# EasyEDA Pro project MN42_v2.eprj, board MOAR_Board
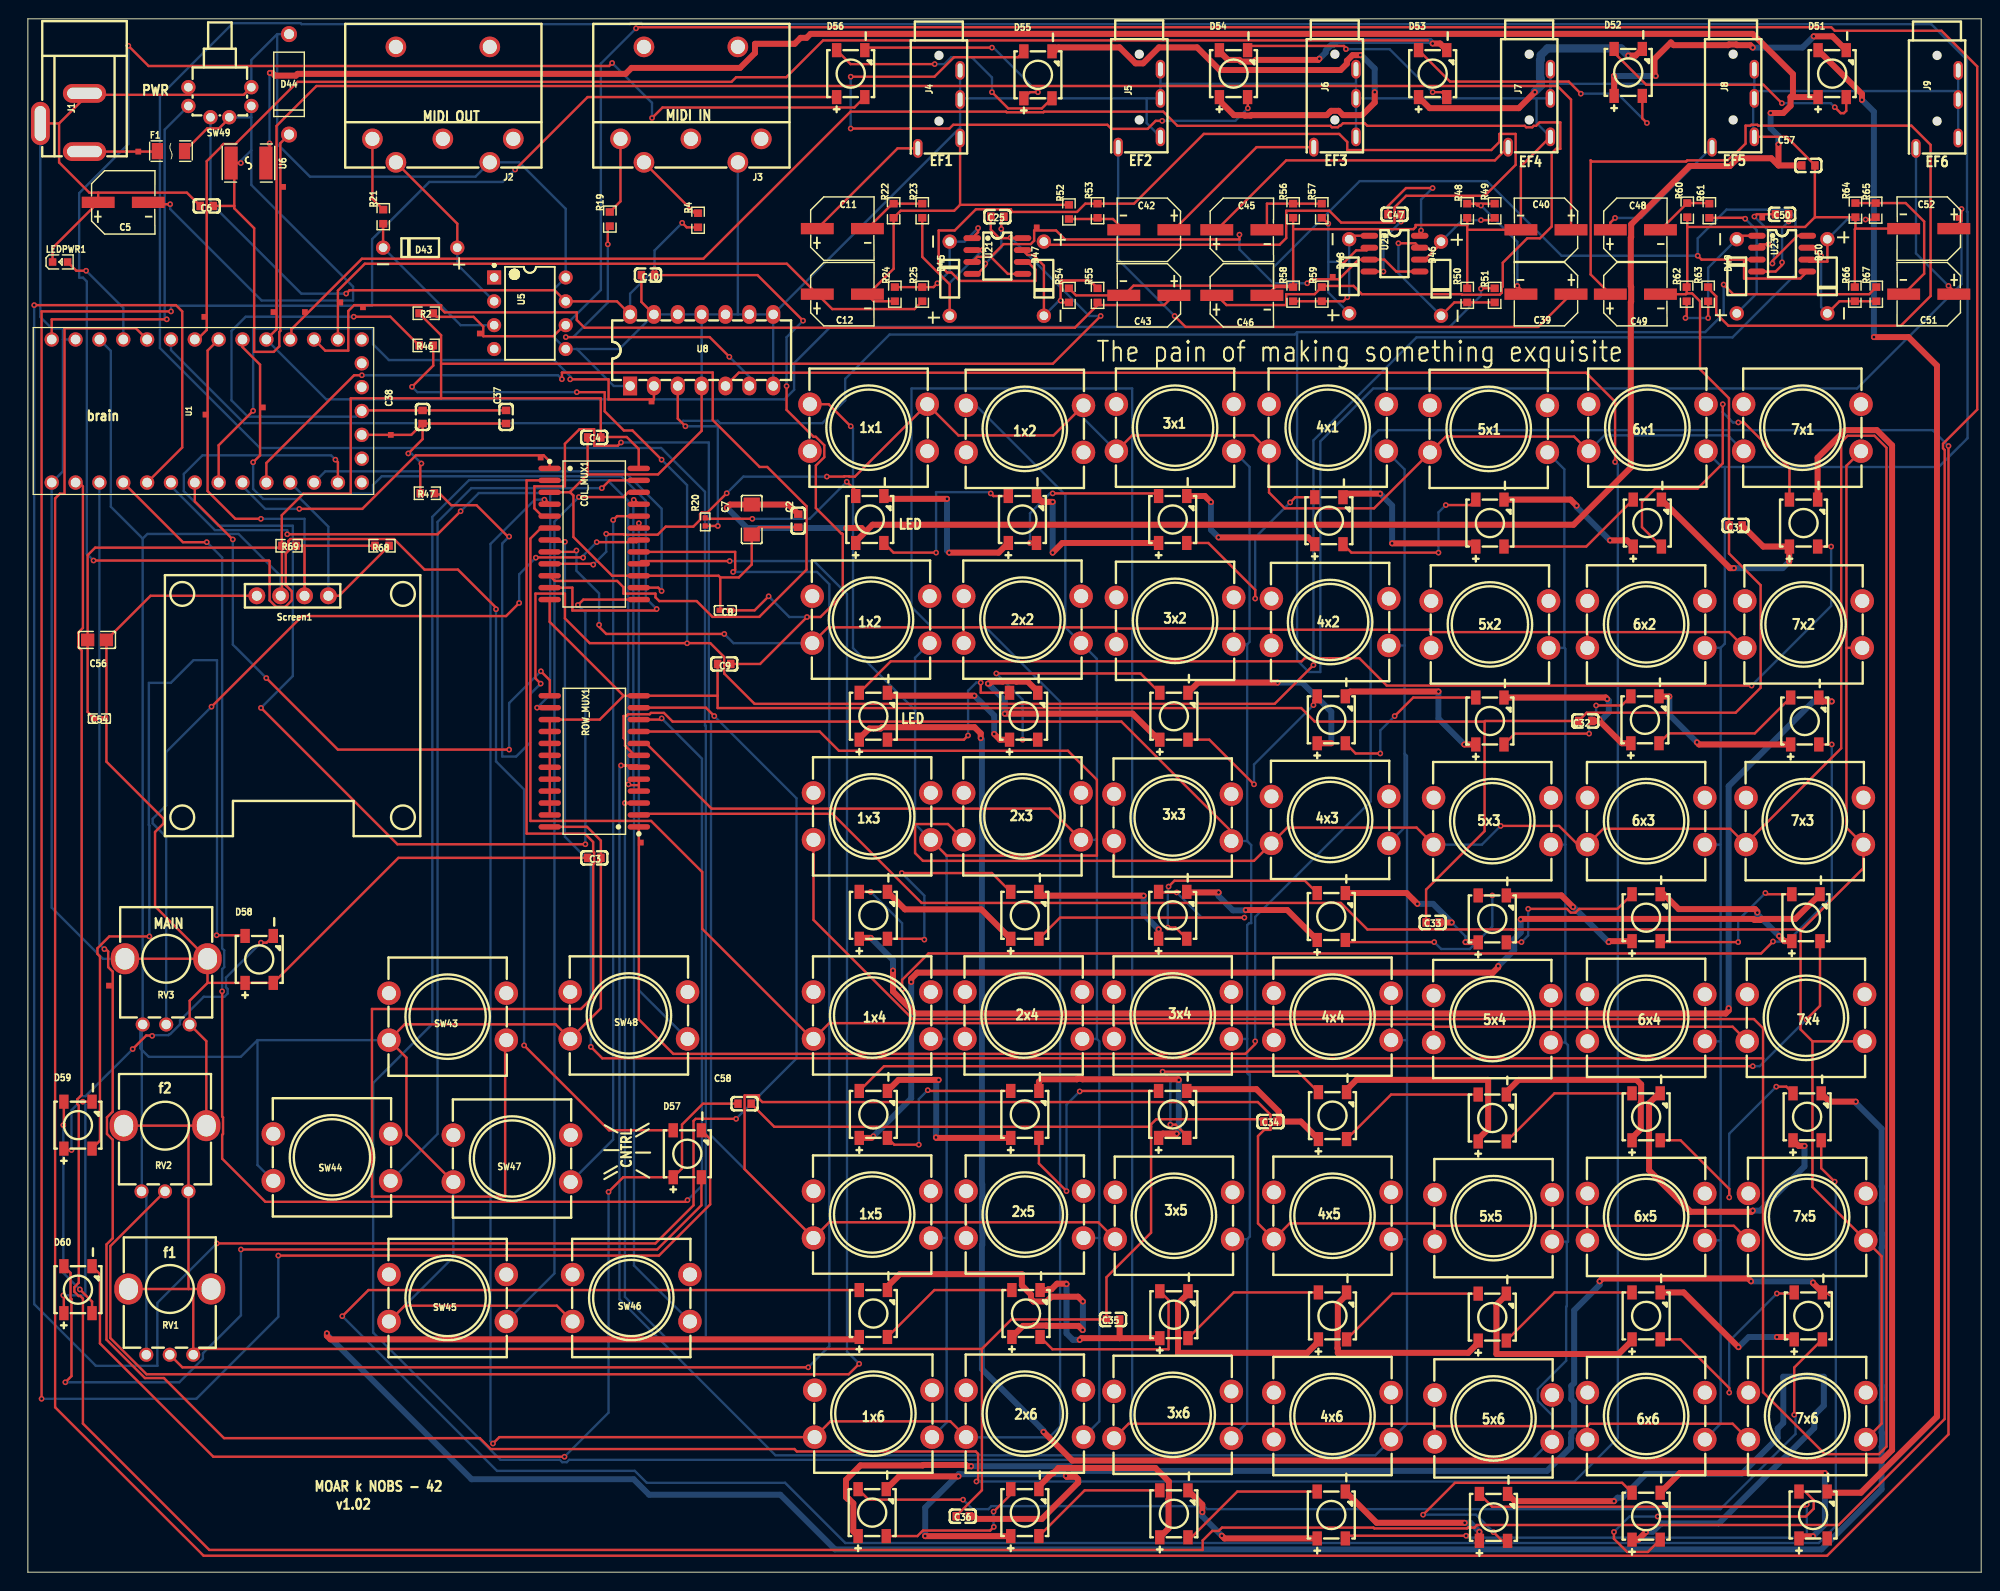
[diagram p3: board, top side]
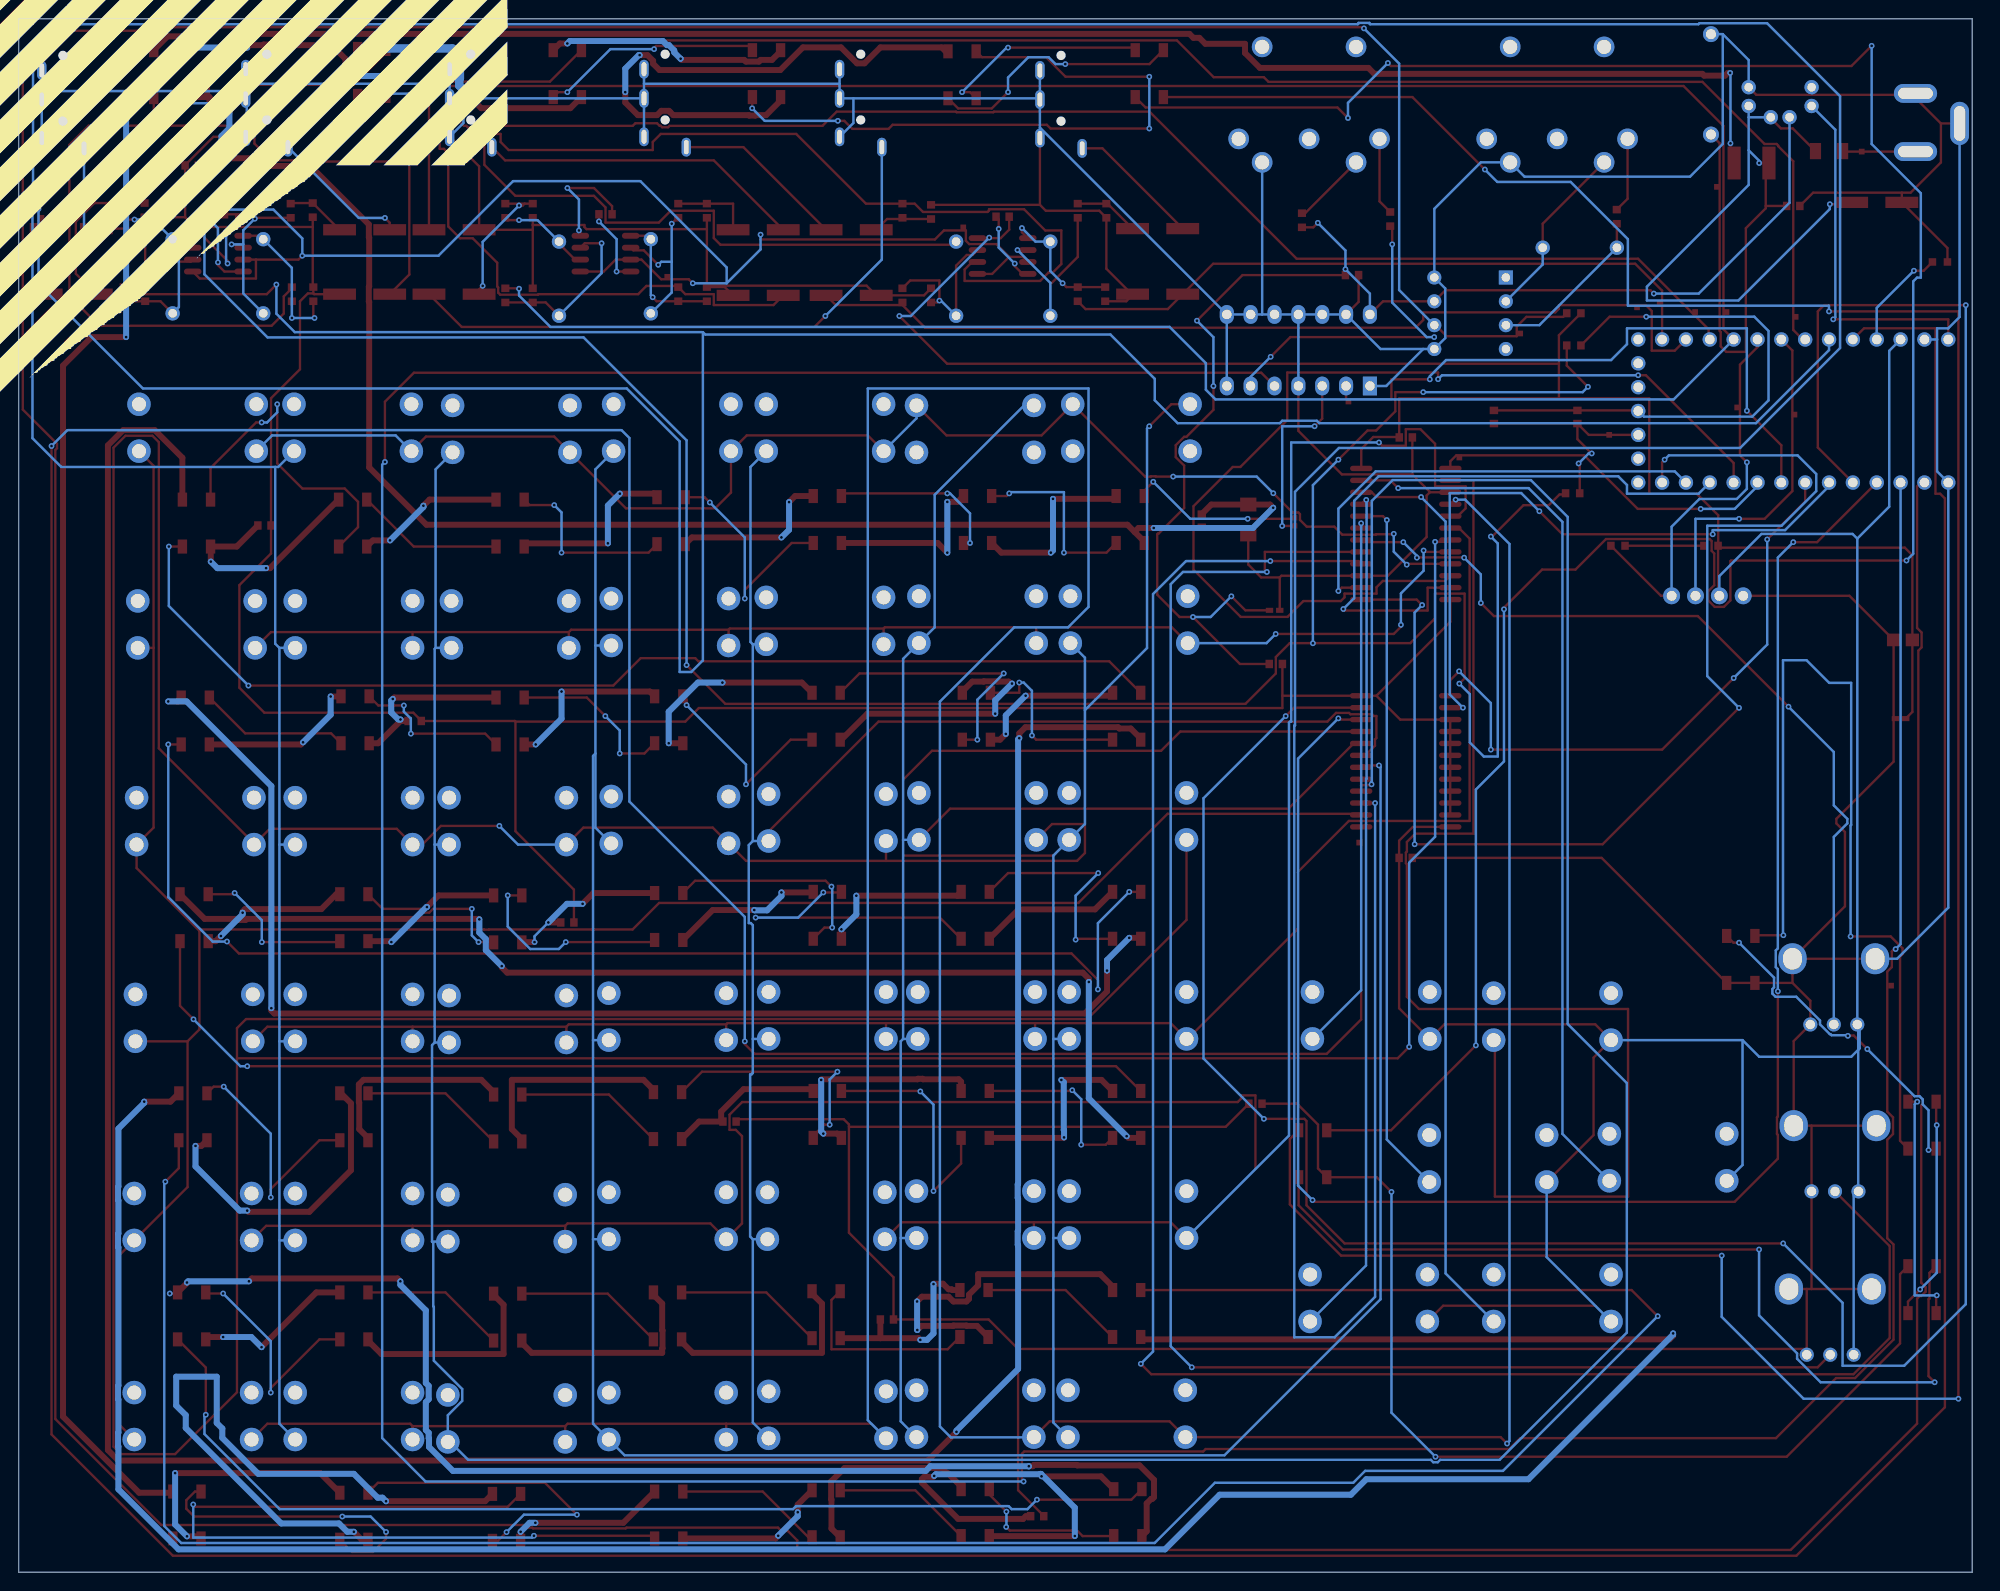
[diagram p4: board, bottom side, seen from below]

Outline 208.03 x 165.48 mm; copper layers: Top Layer, Bottom Layer. Coordinates in mm from the lower left corner of the outline.
Outline path: 0,165.48 0,0 208.03,0 208.03,165.48 0,165.48
Stack: Top Layer 0.035mm / Dielectric1 1.51mm FR4 er 4.5 / Bottom Layer 0.035mm

## Design rules (mm)
template: User Custom Config
spacing safeClearance (default): track to track 0.152, other pairs 0.152 to 0.3
track width trackWidth (default): min 0.127, default 0.254, max 2.54
differential pair differentialPair (default): width min 0.127, default 0.254, max 2.54; gap min 0.152, default 0.152
via viaSize (default): diameter min 0.5, default 0.61, max 10; hole min 0.3, default 0.305, max 5.999

## Placement (name value [footprint] x y rotation side)
C2  100nF  [C0603]  82.04 112.01 270 top
C3  100nF  [C0603]  60.33 76.09 0 top
C4  100nF  [C0603]  60.31 120.88 0 top
C5  220uF  [CAP-SMD_BD6.3-L6.6-W6.6-FD]  10.16 145.92 0 top
C6  100nF  [C0603]  19.05 145.54 0 top
C7  100uF  [C1206]  77.09 112.14 90 top
C8  1uF  [C0402]  74.28 102.47 180 top
C9  100nF  [C0603]  74.16 96.75 180 top
C10  100nF  [C0603]  66.04 138.18 0 top
C11  1uF  [CAP-SMD_BD6.3-L6.6-W6.6-FD]  86.74 143.13 0 top
C12  1uF  [CAP-SMD_BD6.3-L6.6-W6.6-FD]  86.74 136.14 0 top
C25  100nF  [C0603]  103.25 144.4 180 top
C31  100nF  [C0603]  181.86 111.51 180 top
C32  100nF  [C0603]  165.86 90.68 180 top
C33  100nF  [C0603]  149.61 69.22 180 top
C34  100nF  [C0603]  132.33 48.01 180 top
C35  100nF  [C0603]  115.57 26.92 180 top
C36  100nF  [C0603]  99.57 5.97 180 top
C37  100nF  [C0603]  50.93 123.06 270 top
C38  4.7uF  [C0603]  42.04 123.06 270 top
C39  1uF  [CAP-SMD_BD6.3-L6.6-W6.6-FD]  161.67 136.14 180 top
C40  1uF  [CAP-SMD_BD6.3-L6.6-W6.6-FD]  161.67 143 180 top
C42  1uF  [CAP-SMD_BD6.3-L6.6-W6.6-FD]  119.38 143 180 top
C43  1uF  [CAP-SMD_BD6.3-L6.6-W6.6-FD]  119.38 136.02 180 top
C45  1uF  [CAP-SMD_BD6.3-L6.6-W6.6-FD]  129.29 143 0 top
C46  1uF  [CAP-SMD_BD6.3-L6.6-W6.6-FD]  129.29 136.02 0 top
C47  100nF  [C0603]  145.54 144.65 180 top
C48  1uF  [CAP-SMD_BD6.3-L6.6-W6.6-FD]  171.2 143 0 top
C49  1uF  [CAP-SMD_BD6.3-L6.6-W6.6-FD]  171.2 136.14 0 top
C50  100nF  [C0603]  186.82 144.65 180 top
C51  1uF  [CAP-SMD_BD6.3-L6.6-W6.6-FD]  202.44 136.14 180 top
C52  1uF  [CAP-SMD_BD6.3-L6.6-W6.6-FD]  202.44 143.13 180 top
C54  1uF  [C0402]  7.62 90.93 0 top
C56  10uF  [C0805]  7.37 99.31 0 top
C57  100nF  [C0603]  189.61 149.86 0 top
C58  100nF  [C0603]  76.33 49.91 0 top
COL_MUX1  CD74HC4067M96  [SOIC-24_L15.4-W7.5-P1.27-LS10.3-BL]  60.31 110.6 270 top
D1  XL-5050RGBC-WS2812B  [LED-SMD_4P-L5.0-W5.0-BL_XL-5050RGBC]  89.66 112.14 0 top
D2  XL-5050RGBC-WS2812B  [LED-SMD_4P-L5.0-W5.0-BL_XL-5050RGBC]  105.92 112.14 0 top
D3  XL-5050RGBC-WS2812B  [LED-SMD_4P-L5.0-W5.0-BL_XL-5050RGBC]  121.92 112.14 0 top
D4  XL-5050RGBC-WS2812B  [LED-SMD_4P-L5.0-W5.0-BL_XL-5050RGBC]  138.56 112.01 0 top
D5  XL-5050RGBC-WS2812B  [LED-SMD_4P-L5.0-W5.0-BL_XL-5050RGBC]  155.7 111.76 0 top
D6  XL-5050RGBC-WS2812B  [LED-SMD_4P-L5.0-W5.0-BL_XL-5050RGBC]  172.47 111.76 0 top
D7  XL-5050RGBC-WS2812B  [LED-SMD_4P-L5.0-W5.0-BL_XL-5050RGBC]  189.1 111.76 0 top
D8  XL-5050RGBC-WS2812B  [LED-SMD_4P-L5.0-W5.0-BL_XL-5050RGBC]  90.04 91.19 0 top
D9  XL-5050RGBC-WS2812B  [LED-SMD_4P-L5.0-W5.0-BL_XL-5050RGBC]  106.05 91.19 0 top
D10  XL-5050RGBC-WS2812B  [LED-SMD_4P-L5.0-W5.0-BL_XL-5050RGBC]  122.05 91.19 0 top
D11  XL-5050RGBC-WS2812B  [LED-SMD_4P-L5.0-W5.0-BL_XL-5050RGBC]  138.81 90.8 0 top
D12  XL-5050RGBC-WS2812B  [LED-SMD_4P-L5.0-W5.0-BL_XL-5050RGBC]  155.7 90.68 0 top
D13  XL-5050RGBC-WS2812B  [LED-SMD_4P-L5.0-W5.0-BL_XL-5050RGBC]  172.21 90.8 0 top
D14  XL-5050RGBC-WS2812B  [LED-SMD_4P-L5.0-W5.0-BL_XL-5050RGBC]  189.23 90.68 0 top
D15  XL-5050RGBC-WS2812B  [LED-SMD_4P-L5.0-W5.0-BL_XL-5050RGBC]  90.04 69.98 0 top
D16  XL-5050RGBC-WS2812B  [LED-SMD_4P-L5.0-W5.0-BL_XL-5050RGBC]  106.17 69.98 0 top
D17  XL-5050RGBC-WS2812B  [LED-SMD_4P-L5.0-W5.0-BL_XL-5050RGBC]  121.92 69.98 0 top
D18  XL-5050RGBC-WS2812B  [LED-SMD_4P-L5.0-W5.0-BL_XL-5050RGBC]  138.81 69.85 0 top
D19  XL-5050RGBC-WS2812B  [LED-SMD_4P-L5.0-W5.0-BL_XL-5050RGBC]  155.96 69.6 0 top
D20  XL-5050RGBC-WS2812B  [LED-SMD_4P-L5.0-W5.0-BL_XL-5050RGBC]  172.34 69.72 0 top
D21  XL-5050RGBC-WS2812B  [LED-SMD_4P-L5.0-W5.0-BL_XL-5050RGBC]  189.36 69.72 0 top
D22  XL-5050RGBC-WS2812B  [LED-SMD_4P-L5.0-W5.0-BL_XL-5050RGBC]  90.04 48.77 0 top
D23  XL-5050RGBC-WS2812B  [LED-SMD_4P-L5.0-W5.0-BL_XL-5050RGBC]  106.17 48.77 0 top
D24  XL-5050RGBC-WS2812B  [LED-SMD_4P-L5.0-W5.0-BL_XL-5050RGBC]  121.92 48.77 0 top
D25  XL-5050RGBC-WS2812B  [LED-SMD_4P-L5.0-W5.0-BL_XL-5050RGBC]  138.94 48.64 0 top
D26  XL-5050RGBC-WS2812B  [LED-SMD_4P-L5.0-W5.0-BL_XL-5050RGBC]  155.96 48.39 0 top
D27  XL-5050RGBC-WS2812B  [LED-SMD_4P-L5.0-W5.0-BL_XL-5050RGBC]  172.34 48.51 0 top
D28  XL-5050RGBC-WS2812B  [LED-SMD_4P-L5.0-W5.0-BL_XL-5050RGBC]  189.48 48.51 0 top
D29  XL-5050RGBC-WS2812B  [LED-SMD_4P-L5.0-W5.0-BL_XL-5050RGBC]  90.04 27.56 0 top
D30  XL-5050RGBC-WS2812B  [LED-SMD_4P-L5.0-W5.0-BL_XL-5050RGBC]  106.3 27.56 0 top
D31  XL-5050RGBC-WS2812B  [LED-SMD_4P-L5.0-W5.0-BL_XL-5050RGBC]  122.05 27.43 0 top
D32  XL-5050RGBC-WS2812B  [LED-SMD_4P-L5.0-W5.0-BL_XL-5050RGBC]  138.94 27.31 0 top
D33  XL-5050RGBC-WS2812B  [LED-SMD_4P-L5.0-W5.0-BL_XL-5050RGBC]  155.96 27.18 0 top
D34  XL-5050RGBC-WS2812B  [LED-SMD_4P-L5.0-W5.0-BL_XL-5050RGBC]  172.34 27.31 0 top
D35  XL-5050RGBC-WS2812B  [LED-SMD_4P-L5.0-W5.0-BL_XL-5050RGBC]  189.61 27.31 0 top
D36  XL-5050RGBC-WS2812B  [LED-SMD_4P-L5.0-W5.0-BL_XL-5050RGBC]  89.92 6.35 0 top
D37  XL-5050RGBC-WS2812B  [LED-SMD_4P-L5.0-W5.0-BL_XL-5050RGBC]  106.17 6.35 0 top
D38  XL-5050RGBC-WS2812B  [LED-SMD_4P-L5.0-W5.0-BL_XL-5050RGBC]  122.05 6.22 0 top
D39  XL-5050RGBC-WS2812B  [LED-SMD_4P-L5.0-W5.0-BL_XL-5050RGBC]  138.81 6.1 0 top
D40  XL-5050RGBC-WS2812B  [LED-SMD_4P-L5.0-W5.0-BL_XL-5050RGBC]  156.08 5.84 0 top
D41  XL-5050RGBC-WS2812B  [LED-SMD_4P-L5.0-W5.0-BL_XL-5050RGBC]  172.34 5.97 0 top
D42  XL-5050RGBC-WS2812B  [LED-SMD_4P-L5.0-W5.0-BL_XL-5050RGBC]  190.12 6.1 0 top
D43  1N4148PF  [DO-35_BD1.9-L3.9-P7.90-D0.5-FD]  41.78 141.1 180 top
D44  SA6.0A  [DO-15_BD3.1-L6.7-P10.70-D0.8-RD]  27.81 158.5 90 top
D45  1N4148PF  [DO-35_BD1.9-L3.9-P7.90-D0.5-FD]  98.17 137.79 90 top
D46  1N4148PF  [DO-35_BD1.9-L3.9-P7.90-D0.5-FD]  150.5 137.79 270 top
D47  1N4148PF  [DO-35_BD1.9-L3.9-P7.90-D0.5-FD]  108.2 137.79 270 top
D48  1N4148PF  [DO-35_BD1.9-L3.9-P7.90-D0.5-FD]  140.72 138.05 90 top
D49  1N4148PF  [DO-35_BD1.9-L3.9-P7.90-D0.5-FD]  181.99 138.05 90 top
D50  1N4148PF  [DO-35_BD1.9-L3.9-P7.90-D0.5-FD]  191.64 138.05 270 top
D51  XL-5050RGBC-WS2812B  [LED-SMD_4P-L5.0-W5.0-BL_XL-5050RGBC]  192.15 159.64 0 top
D52  XL-5050RGBC-WS2812B  [LED-SMD_4P-L5.0-W5.0-BL_XL-5050RGBC]  170.43 159.77 0 top
D53  XL-5050RGBC-WS2812B  [LED-SMD_4P-L5.0-W5.0-BL_XL-5050RGBC]  149.61 159.64 0 top
D54  XL-5050RGBC-WS2812B  [LED-SMD_4P-L5.0-W5.0-BL_XL-5050RGBC]  128.4 159.64 0 top
D55  XL-5050RGBC-WS2812B  [LED-SMD_4P-L5.0-W5.0-BL_XL-5050RGBC]  107.57 159.51 0 top
D56  XL-5050RGBC-WS2812B  [LED-SMD_4P-L5.0-W5.0-BL_XL-5050RGBC]  87.63 159.64 0 top
D57  XL-5050RGBC-WS2812B  [LED-SMD_4P-L5.0-W5.0-BL_XL-5050RGBC]  70.23 44.58 0 top
D58  XL-5050RGBC-WS2812B  [LED-SMD_4P-L5.0-W5.0-BL_XL-5050RGBC]  24.64 65.28 0 top
D59  XL-5050RGBC-WS2812B  [LED-SMD_4P-L5.0-W5.0-BL_XL-5050RGBC]  5.33 47.62 0 top
D60  XL-5050RGBC-WS2812B  [LED-SMD_4P-L5.0-W5.0-BL_XL-5050RGBC]  5.33 30.1 0 top
F1  nSMD050-33V  [F1206]  15.24 151.38 0 top
J1  DC005  [DC-IN-TH_DC005]  3.68 154.43 270 top
J2  DIN-504B-M10  [CONN-TH_DIN-504B-M10]  44.2 156.34 180 top
J3  DIN-504B-M10  [CONN-TH_DIN-504B-M10]  70.61 156.34 180 top
J4  HC-PJ-320A  [AUDIO-SMD_HC-PJ-320A]  97.03 155.83 270 top
J5  HC-PJ-320A  [AUDIO-SMD_HC-PJ-320A]  118.36 155.96 270 top
J6  HC-PJ-320A  [AUDIO-SMD_HC-PJ-320A]  139.19 155.96 270 top
J7  HC-PJ-320A  [AUDIO-SMD_HC-PJ-320A]  159.89 155.96 270 top
J8  HC-PJ-320A  [AUDIO-SMD_HC-PJ-320A]  181.61 155.96 270 top
J9  HC-PJ-320A  [AUDIO-SMD_HC-PJ-320A]  203.33 155.83 270 top
LEDPWR1  NCD0603W1  [LED0603-RD]  3.43 139.57 0 top
NOREF  -  [Pad_e222]  107.44 143.26 0 top
NOREF#2  -  [Pad_e6017]  66.42 124.71 0 top
NOREF#3  -  [Pad_e229]  184.7 144.3 0 top
NOREF#4  -  [Pad_e215]  38.65 121.16 0 top
NOREF#5  -  [Pad_e6029]  205.61 144.27 0 top
NOREF#6  -  [Pad_e6019]  18.8 133.73 0 top
NOREF#7  -  [Pad_e6022]  35.69 134.75 0 top
NOREF#8  -  [Pad_e6021]  29.5 134.24 0 top
NOREF#9  -  [Pad_e223]  138.96 137.99 0 top
NOREF#10  -  [Pad_e6036]  25.02 124.08 0 top
NOREF#11  -  [Pad_e213]  27.18 147.57 0 top
NOREF#12  -  [Pad_e6015]  8.64 62.48 0 top
NOREF#13  -  [Pad_e6023]  33.27 135.25 0 top
NOREF#14  -  [Pad_e146]  11.76 151.33 0 top
NOREF#15  -  [Pad_e6020]  26.16 134.24 0 top
NOREF#16  -  [Pad_e6013]  48.13 131.95 0 top
NOREF#17  -  [Pad_e6035]  18.92 123.32 0 top
NOREF#18  -  [Pad_e234]  54.61 118.74 0 top
NOREF#19  -  [Pad_e236]  65.28 77.72 0 top
R2  4.7kΩ  [R0603]  42.42 134.11 0 top
R4  220Ω  [R0603]  71.37 144.02 270 top
R19  220Ω  [R0603]  61.98 144.14 270 top
R20  33Ω  [R0402]  72.14 111.89 90 top
R21  220Ω  [R0603]  37.85 144.4 90 top
R22  100kΩ  [R0603]  92.2 145.03 90 top
R23  10kΩ  [R0603]  95.25 145.03 90 top
R24  20kΩ  [R0603]  92.33 136.14 270 top
R25  4.7kΩ  [R0603]  95.25 136.14 270 top
R46  100kΩ  [R0603]  42.42 130.68 0 top
R47  100kΩ  [R0603]  42.55 114.94 0 top
R48  100kΩ  [R0603]  153.29 145.03 90 top
R49  10kΩ  [R0603]  156.21 145.03 90 top
R50  20kΩ  [R0603]  153.29 136.02 90 top
R51  4.7kΩ  [R0603]  156.21 136.02 90 top
R52  100kΩ  [R0603]  110.87 144.91 270 top
R53  10kΩ  [R0603]  113.92 145.03 270 top
R54  20kΩ  [R0603]  110.87 136.02 90 top
R55  4.7kΩ  [R0603]  113.92 136.02 270 top
R56  100kΩ  [R0603]  134.75 145.03 90 top
R57  10kΩ  [R0603]  137.8 145.03 90 top
R58  20kΩ  [R0603]  134.75 136.14 90 top
R59  4.7kΩ  [R0603]  137.8 136.14 90 top
R60  100kΩ  [R0603]  176.72 145.1 90 top
R61  10kΩ  [R0603]  179.07 145.03 90 top
R62  20kΩ  [R0603]  176.66 136.14 90 top
R63  4.7kΩ  [R0603]  178.94 136.14 90 top
R64  100kΩ  [R0603]  194.63 145.1 90 top
R65  10kΩ  [R0603]  196.79 145.1 90 top
R66  20kΩ  [R0603]  194.56 136.14 90 top
R67  4.7kΩ  [R0603]  196.85 136.14 90 top
R68  4.7kΩ  [R0603]  37.72 109.35 0 top
R69  4.7kΩ  [R0603]  27.81 109.35 0 top
ROW_MUX1  CD74HC4067M96  [SOIC-24_L15.4-W7.5-P1.27-LS10.3-BL]  60.33 86.38 90 top
RV1  10kΩ  [RES-ADJ-TH_RK09K1130A5R]  15.11 26.67 0 top
RV2  10kΩ  [RES-ADJ-TH_RK09K1130A5R]  14.61 44.07 0 top
RV3  10kΩ  [RES-ADJ-TH_RK09K1130A5R]  14.73 61.85 0 top
Screen1  HS96L03W2C03  [OLED-TH_L27.8-W27.2-P2.54_C9900033791]  28.19 104.01 0 top
SW1  HX B3F-4055-Y  [SW-TH_4P-L12.0-W12.0-P5.00-LS12.5]  89.54 121.92 0 top
SW2  HX B3F-4055-Y  [SW-TH_4P-L12.0-W12.0-P5.00-LS12.5]  106.17 121.79 0 top
SW3  HX B3F-4055-Y  [SW-TH_4P-L12.0-W12.0-P5.00-LS12.5]  122.17 121.92 180 top
SW4  HX B3F-4055-Y  [SW-TH_4P-L12.0-W12.0-P5.00-LS12.5]  138.43 121.92 180 top
SW5  HX B3F-4055-Y  [SW-TH_4P-L12.0-W12.0-P5.00-LS12.5]  155.57 121.79 180 top
SW6  HX B3F-4055-Y  [SW-TH_4P-L12.0-W12.0-P5.00-LS12.5]  172.47 121.92 180 top
SW7  HX B3F-4055-Y  [SW-TH_4P-L12.0-W12.0-P5.00-LS12.5]  188.98 121.92 180 top
SW8  HX B3F-4055-Y  [SW-TH_4P-L12.0-W12.0-P5.00-LS12.5]  89.79 101.47 180 top
SW9  HX B3F-4055-Y  [SW-TH_4P-L12.0-W12.0-P5.00-LS12.5]  105.92 101.47 180 top
SW10  HX B3F-4055-Y  [SW-TH_4P-L12.0-W12.0-P5.00-LS12.5]  122.17 101.35 180 top
SW11  HX B3F-4055-Y  [SW-TH_4P-L12.0-W12.0-P5.00-LS12.5]  138.68 101.22 180 top
SW12  HX B3F-4055-Y  [SW-TH_4P-L12.0-W12.0-P5.00-LS12.5]  155.7 100.97 180 top
SW13  HX B3F-4055-Y  [SW-TH_4P-L12.0-W12.0-P5.00-LS12.5]  172.34 100.97 180 top
SW14  HX B3F-4055-Y  [SW-TH_4P-L12.0-W12.0-P5.00-LS12.5]  189.1 100.97 180 top
SW15  HX B3F-4055-Y  [SW-TH_4P-L12.0-W12.0-P5.00-LS12.5]  89.92 80.52 180 top
SW16  HX B3F-4055-Y  [SW-TH_4P-L12.0-W12.0-P5.00-LS12.5]  105.92 80.52 180 top
SW17  HX B3F-4055-Y  [SW-TH_4P-L12.0-W12.0-P5.00-LS12.5]  121.92 80.39 180 top
SW18  HX B3F-4055-Y  [SW-TH_4P-L12.0-W12.0-P5.00-LS12.5]  138.68 80.14 180 top
SW19  HX B3F-4055-Y  [SW-TH_4P-L12.0-W12.0-P5.00-LS12.5]  155.96 80.01 180 top
SW20  HX B3F-4055-Y  [SW-TH_4P-L12.0-W12.0-P5.00-LS12.5]  172.34 80.01 180 top
SW21  HX B3F-4055-Y  [SW-TH_4P-L12.0-W12.0-P5.00-LS12.5]  189.23 80.01 180 top
SW22  HX B3F-4055-Y  [SW-TH_4P-L12.0-W12.0-P5.00-LS12.5]  89.92 59.31 180 top
SW23  HX B3F-4055-Y  [SW-TH_4P-L12.0-W12.0-P5.00-LS12.5]  106.05 59.31 180 top
SW24  HX B3F-4055-Y  [SW-TH_4P-L12.0-W12.0-P5.00-LS12.5]  121.92 59.31 180 top
SW25  HX B3F-4055-Y  [SW-TH_4P-L12.0-W12.0-P5.00-LS12.5]  138.94 59.18 180 top
SW26  HX B3F-4055-Y  [SW-TH_4P-L12.0-W12.0-P5.00-LS12.5]  155.96 58.93 180 top
SW27  HX B3F-4055-Y  [SW-TH_4P-L12.0-W12.0-P5.00-LS12.5]  172.34 59.06 180 top
SW28  HX B3F-4055-Y  [SW-TH_4P-L12.0-W12.0-P5.00-LS12.5]  189.36 59.06 180 top
SW29  HX B3F-4055-Y  [SW-TH_4P-L12.0-W12.0-P5.00-LS12.5]  89.92 38.1 180 top
SW30  HX B3F-4055-Y  [SW-TH_4P-L12.0-W12.0-P5.00-LS12.5]  106.17 38.1 180 top
SW31  HX B3F-4055-Y  [SW-TH_4P-L12.0-W12.0-P5.00-LS12.5]  122.05 37.97 180 top
SW32  HX B3F-4055-Y  [SW-TH_4P-L12.0-W12.0-P5.00-LS12.5]  138.94 37.97 180 top
SW33  HX B3F-4055-Y  [SW-TH_4P-L12.0-W12.0-P5.00-LS12.5]  156.08 37.72 180 top
SW34  HX B3F-4055-Y  [SW-TH_4P-L12.0-W12.0-P5.00-LS12.5]  172.34 37.85 180 top
SW35  HX B3F-4055-Y  [SW-TH_4P-L12.0-W12.0-P5.00-LS12.5]  189.48 37.85 180 top
SW36  HX B3F-4055-Y  [SW-TH_4P-L12.0-W12.0-P5.00-LS12.5]  90.04 16.89 180 top
SW37  HX B3F-4055-Y  [SW-TH_4P-L12.0-W12.0-P5.00-LS12.5]  106.17 16.89 180 top
SW38  HX B3F-4055-Y  [SW-TH_4P-L12.0-W12.0-P5.00-LS12.5]  121.92 16.76 180 top
SW39  HX B3F-4055-Y  [SW-TH_4P-L12.0-W12.0-P5.00-LS12.5]  138.94 16.64 180 top
SW40  HX B3F-4055-Y  [SW-TH_4P-L12.0-W12.0-P5.00-LS12.5]  156.08 16.38 180 top
SW41  HX B3F-4055-Y  [SW-TH_4P-L12.0-W12.0-P5.00-LS12.5]  172.34 16.64 180 top
SW42  HX B3F-4055-Y  [SW-TH_4P-L12.0-W12.0-P5.00-LS12.5]  189.48 16.64 180 top
SW43  HX B3F-4055-Y  [SW-TH_4P-L12.0-W12.0-P5.00-LS12.5]  44.7 59.18 180 top
SW44  HX B3F-4055-Y  [SW-TH_4P-L12.0-W12.0-P5.00-LS12.5]  32.39 44.2 180 top
SW45  HX B3F-4055-Y  [SW-TH_4P-L12.0-W12.0-P5.00-LS12.5]  44.7 29.21 180 top
SW46  HX B3F-4055-Y  [SW-TH_4P-L12.0-W12.0-P5.00-LS12.5]  64.26 29.21 180 top
SW47  HX B3F-4055-Y  [SW-TH_4P-L12.0-W12.0-P5.00-LS12.5]  51.56 44.07 180 top
SW48  HX B3F-4055-Y  [SW-TH_4P-L12.0-W12.0-P5.00-LS12.5]  64.01 59.31 180 top
SW49  TK-6580A-1  [SW-TH_TK-6580A-1]  20.45 156.59 180 top
U1  Teensy  [teensy 4.0:MODULE_DEV-15583]  19.05 123.7 90 top
U5  6N138  [DIP-8_L9.8-W6.6-P2.54-LS7.6-BL]  53.47 134.11 270 top
U6  1812L200/33GR  [F1812]  23.5 150.11 0 top
U8  SN74AHCT125N  [PDIP-14_L19.3-W6.4-P2.54-LS7.6-BL]  71.75 130.18 0 top
U21  MCP6002DRG  [SOP-8_L4.9-W3.9-P1.27-LS6.0-BL]  103.25 140.21 270 top
U22  MCP6002DRG  [SOP-8_L4.9-W3.9-P1.27-LS6.0-BL]  145.54 140.46 270 top
U23  MCP6002DRG  [SOP-8_L4.9-W3.9-P1.27-LS6.0-BL]  186.82 140.46 270 top

## Footprints (pads in the part's own frame, mm; a bottom-side part is the same pattern mirrored in y, then rotated)
AUDIO-SMD_HC-PJ-320A
  oval 2x1 hole 1.5x0.5: 1(4.15,-2.25) 2(-4.15,2.25) 3(-1.05,2.25) 4(3.05,2.25)
C0402
  rect 0.79x0.54 smd: 1(-0.545,0) 2(0.545,0)
C0603
  rect 0.8x0.9 smd: 1(-0.7,0) 2(0.7,0)
C0805
  rect 1.41x1.35 smd: 1(-1,0) 2(1,0)
C1206
  rect 1.485x1.728 smd: 1(-1.593,0) 2(1.593,0)
CAP-SMD_BD6.3-L6.6-W6.6-FD
  rect 3.5x1.2 smd: 1(-2.67,0) 2(2.67,0)
CONN-TH_DIN-504B-M10
  round 2.2 hole 1.5: 1(-7.5,3.65) 2(-5,6.15) 3(0,3.65) 4(5,6.15) 5(7.5,3.65) 6(-5,-6.15) 7(5,-6.15)
DC-IN-TH_DC005
  oval 2x4.6 hole 1.2x3.7: 1(3.1,2.35) 2(-3.1,2.35)
  oval 4.6x2 hole 3.7x1.2: 3(0.1,-2.35)
DIP-8_L9.8-W6.6-P2.54-LS7.6-BL
  rect 1.5x1.5 hole 0.9: 1(-3.81,-3.81)
  round 1.5 hole 0.9: 2(-1.27,-3.81) 3(1.27,-3.81) 4(3.81,-3.81) 5(3.81,3.81) 6(1.27,3.81) 7(-1.27,3.81) 8(-3.81,3.81)
DO-15_BD3.1-L6.7-P10.70-D0.8-RD
  round 1.7 hole 1.06: 1(-5.35,0) 2(5.35,0)
DO-35_BD1.9-L3.9-P7.90-D0.5-FD
  round 1.524 hole 0.914: 1(-3.95,0) 2(3.95,0)
F1206
  rect 1.19x1.728 smd: 1(-1.445,0) 2(1.445,0)
F1812
  rect 1.407x3.499 smd: 1(-1.853,0) 2(1.853,0)
LED0603-RD
  rect 0.8x0.8 smd: 1(-0.799,0) 2(0.799,0)
LED-SMD_4P-L5.0-W5.0-BL_XL-5050RGBC
  rect 1x1.5 smd: 1(-1.5,-2.5) 2(1.5,-2.5) 3(1.5,2.5) 4(-1.5,2.5)
OLED-TH_L27.8-W27.2-P2.54_C9900033791
  round 1.8 hole 1.05: 1(-3.81,0) 2(-1.27,0) 3(1.27,0) 4(3.81,0)
Pad_e146
  rect 0.61x0.61 smd: TP2(0,0)
Pad_e213
  rect 0.61x0.61 smd: TP3(0,0)
Pad_e215
  rect 0.61x0.61 smd: TP4(0,0)
Pad_e222
  rect 0.61x0.61 smd: TP5(0,0)
Pad_e223
  rect 0.61x0.61 smd: TP6(0,0)
Pad_e229
  rect 0.61x0.61 smd: TP7(0,0)
Pad_e234
  rect 0.61x0.61 smd: TP8(0,0)
Pad_e236
  rect 0.61x0.61 smd: TP9(0,0)
Pad_e6013
  rect 0.61x0.61 smd: TP10(0,0)
Pad_e6015
  rect 0.61x0.61 smd: TP11(0,0)
Pad_e6017
  rect 0.61x0.61 smd: TP12(0,0)
Pad_e6019
  rect 0.61x0.61 smd: TP13(0,0)
Pad_e6020
  rect 0.61x0.61 smd: TP14(0,0)
Pad_e6021
  rect 0.61x0.61 smd: TP15(0,0)
Pad_e6022
  rect 0.61x0.61 smd: TP16(0,0)
Pad_e6023
  rect 0.61x0.61 smd: TP17(0,0)
Pad_e6029
  rect 0.61x0.61 smd: TP18(0,0)
Pad_e6035
  rect 0.61x0.61 smd: TP19(0,0)
Pad_e6036
  rect 0.61x0.61 smd: TP20(0,0)
PDIP-14_L19.3-W6.4-P2.54-LS7.6-BL
  rect 1.5x2 hole 1: 1(-7.62,-3.81)
  oval 1.5x2 hole 1: 2(-5.08,-3.81) 3(-2.54,-3.81) 4(0,-3.81) 5(2.54,-3.81) 6(5.08,-3.81) 7(7.62,-3.81) 8(7.62,3.81) 9(5.08,3.81) 10(2.54,3.81) 11(0,3.81) 12(-2.54,3.81) 13(-5.08,3.81) 14(-7.62,3.81)
R0402
  rect 0.566x0.54 smd: 1(-0.433,0) 2(0.433,0)
R0603
  rect 0.806x0.864 smd: 1(-0.753,0) 2(0.753,0)
RES-ADJ-TH_RK09K1130A5R
  round 1.5 hole 1: 1(-2.5,-3.5) 2(0,-3.5) 3(2.5,-3.5)
  oval 3x3.3 hole 2x2.3: 4(4.4,3.5) 5(-4.4,3.5)
SOIC-24_L15.4-W7.5-P1.27-LS10.3-BL
  oval 0.574x2.388 smd: 1(-6.985,-4.744) 2(-5.715,-4.744) 3(-4.445,-4.744) 4(-3.175,-4.744) 5(-1.905,-4.744) 6(-0.635,-4.744) 7(0.635,-4.744) 8(1.905,-4.744) 9(3.175,-4.744) 10(4.445,-4.744) 11(5.715,-4.744) 12(6.985,-4.744) 13(6.985,4.744) 14(5.715,4.744) 15(4.445,4.744) 16(3.175,4.744) 17(1.905,4.744) 18(0.635,4.744) 19(-0.635,4.744) 20(-1.905,4.744) 21(-3.175,4.744) 22(-4.445,4.744) 23(-5.715,4.744) 24(-6.985,4.744)
SOP-8_L4.9-W3.9-P1.27-LS6.0-BL
  oval 0.63x1.865 smd: 1(-1.905,-2.683) 2(-0.635,-2.683) 3(0.635,-2.683) 4(1.905,-2.683) 5(1.905,2.683) 6(0.635,2.683) 7(-0.635,2.683) 8(-1.905,2.683)
SW-TH_4P-L12.0-W12.0-P5.00-LS12.5
  round 2.5 hole 1.5: 1(-6.25,2.5) 2(6.25,2.5) 3(-6.25,-2.5) 4(6.25,-2.5)
SW-TH_TK-6580A-1
  round 1.524 hole 0.914: 1(3.35,-1.6) 2(3.35,0.4) 3(-3.35,-1.6) 4(-3.35,0.4) 5(1,1.6) 6(-1,1.6)
teensy 4.0:MODULE_DEV-15583
  round 1.53 hole 1.02: 0(-7.62,13.97) 1(-7.62,11.43) 2(-7.62,8.89) 3(-7.62,6.35) 3.3V_1(-2.54,-16.51) 3.3V_2(7.62,11.43) 4(-7.62,3.81) 5(-7.62,1.27) 6(-7.62,-1.27) 7(-7.62,-3.81) 8(-7.62,-6.35) 9(-7.62,-8.89) 10(-7.62,-11.43) 11(-7.62,-13.97) 12(-7.62,-16.51) 13(7.62,-16.51) 14(7.62,-13.97) 15(7.62,-11.43) 16(7.62,-8.89) 17(7.62,-6.35) 18(7.62,-3.81) 19(7.62,-1.27) 20(7.62,1.27) 21(7.62,3.81) 22(7.62,6.35) 23(7.62,8.89) G1(-7.62,16.51) G2(0,-16.51) G3(7.62,13.97) ON-OFF(5.08,-16.51) PGM(2.54,-16.51) VBAT(-5.08,-16.51) VIN(7.62,16.51)

## Nets
As in the schematic, except:
GND: C2.2 C3.1 C4.1 C5.1 C6.1 C7.1 C8.2 C9.2 C10.1 C12.2 C31.2 C32.2 C33.2 C34.2 C35.2 C36.2 C40.2 C43.2 C46.2 C49.2 C52.2 C54.2 C56.2 C57.2 C58.2 COL_MUX1.3 COL_MUX1.12 COL_MUX1.15 D44.2 D58.1 D58.2 J1.2 J1.3 J2.2 J3.2 J4.2 J4.3 J4.4 J5.2 J5.3 J5.4 J6.2 J6.3 J6.4 J7.2 J7.3 J7.4 J8.2 J8.3 J8.4 J9.2 J9.3 J9.4 LEDPWR1.1 R22.1 R24.2 R48.1 R50.2 R52.1 R54.2 R56.1 R58.2 R60.1 R62.2 R64.1 R66.2 ROW_MUX1.12 ROW_MUX1.15 ROW_MUX1.16 ROW_MUX1.17 ROW_MUX1.18 ROW_MUX1.19 ROW_MUX1.20 ROW_MUX1.21 ROW_MUX1.22 ROW_MUX1.23 RV1.3 RV1.4 RV1.5 RV2.3 RV2.4 RV2.5 RV3.3 RV3.4 RV3.5 Screen1.1 SW49.1 SW49.3 U1.G1 U1.G3 U5.5 U5.8 U8.1 U8.4 U8.7 U8.8 U8.9 U8.10 U8.11 U8.12 U8.13
VIN_FUSED: C5.2 C6.2 D44.1 F1.2 NOREF#11.TP3 SW49.4 SW49.6 U6.1
VIN_RAW: F1.1 J1.1 NOREF#14.TP2
E1: C12.1 NOREF#13.TP17 R25.2 U1.14
E2: C43.1 NOREF#7.TP16 R55.2 U1.15
E3: C46.1 NOREF#8.TP15 R59.2 U1.16
E4: C40.1 NOREF#15.TP14 R51.2 U1.17
E5: C49.1 NOREF#6.TP13 R63.2 U1.20
E6: C52.1 NOREF#5.TP18 R67.2 U1.21
LED: NOREF#2.TP12 U1.6 U8.2
MIDI_RX: NOREF#16.TP10 R2.2 U1.0 U5.6
MIDI_TX: NOREF#12.TP11 U1.1 U8.5
MRC: COL_MUX1.1 NOREF#18.TP8 U1.7
MRR: NOREF#19.TP9 ROW_MUX1.1 U1.22
SCL: NOREF#17.TP19 R68.1 R69.2 Screen1.3 U1.19
SDA: NOREF#10.TP20 R68.2 Screen1.4 U1.18
VREF: NOREF.TP5 NOREF#9.TP6 R46.2 R47.2 U21.3 U21.5 U22.3 U22.5 U23.3 U23.5
$1N66700: C37.2 C38.2 NOREF#4.TP4 R47.1 U1.3.3V_1
$1N66751: D53.2 D54.3
$1N66753: D54.1 D55.3
$1N66755: D55.1 D56.3
$1N66757: D56.1 D57.3
$1N66770: D53.3 D54.4
$1N66794: C58.1 D57.1 D60.3
$1N66797: D57.2 D60.4
$1N66805: D59.3 D60.1
$1N66809: D58.3 D59.1
$2N10057: C50.2 NOREF#3.TP7 U23.8

Pads without a net: J2 1 3 6 7; J3 1 3 6 7; SW1 3 4; SW2 3 4; SW3 3 4; SW4 3 4; SW5 3 4; SW6 3 4; SW7 3 4; SW8 3 4; SW9 3 4; SW10 3 4; SW11 3 4; SW12 3 4; SW13 3 4; SW14 3 4; SW15 3 4; SW16 3 4; SW17 3 4; SW18 3 4; SW19 3 4; SW20 3 4; SW21 3 4; SW22 3 4; SW23 3 4; SW24 3 4; SW25 3 4; SW26 3 4; SW27 3 4; SW28 3 4; SW29 3 4; SW30 3 4; SW31 3 4; SW32 3 4; SW33 3 4; SW34 3 4; SW35 3 4; SW36 3 4; SW37 3 4; SW38 3 4; SW39 3 4; SW40 3 4; SW41 3 4; SW42 3 4; SW43 3 4; SW44 3 4; SW45 3 4; SW46 3 4; SW47 3 4; SW48 3 4; U1 12 13 ON-OFF PGM VBAT; U5 1 4

## Via types
v1: diameter 0.61, hole 0.305, Top Layer to Bottom Layer, 324 vias

## Routing (per net, layer and track width the routed paths; a pad name or vN(x,y) marks a point on that pad's centre or on a via; arc(x,y) is an arc through that point)
3VDC: length 484.6
  Top Layer w0.254: SW46.2 56.33,28.39 40.14,28.39 SW45.2 ; C54.1 6.37,91.64 C56.1 6.37,108.34 7.17,109.14 27.06,109.14 ; R2.1 44.01,131.77 44.01,128.74 ; 44.01,125.05 61.01,125.05 61.01,120.93 ; 44.01,125.05 34.39,125.05 34.39,114.89 29.33,114.89 27.04,112.6 27.04,109.36 R69.1 27.06,109.14 ; 44.01,125.05 44.01,128.74 ; 44.01,128.74 109.16,128.74 v1(114.25,133.82) ; 61.01,120.93 63.78,120.93 65.06,119.65 COL_MUX1.24 ; 61.01,120.93 C4.2 ; 104.68,142.11 103.45,142.11 102.55,143.02 C25.2 ; 104.68,142.11 U21.8 ; 104.68,142.11 v1(104.68,142.17) ; 27.06,109.14 27.06,104.15 Screen1.2 ; ROW_MUX1.24 59.56,79.4 61.03,77.93 C3.2 61.03,60.08 SW48.2 56.2,58.36 40.14,58.36 SW43.2 40.32,54.82 40.32,46.56 SW47.2
  Bottom Layer w0.254: U1.3.3V_2 8.83,130.11 8.83,113.5 12.23,110.1 ; 24.45,56.68 22.68,54.9 12.88,54.9 12.14,55.65 ; 24.45,56.68 SW43.2 ; 24.45,56.68 24.45,43.38 SW44.2 ; v1(114.25,133.82) 113.02,133.82 v1(104.68,142.17) ; 12.14,58.25 11.98,58.09 11.98,55.8 12.14,55.65 ; 12.14,58.25 RV3.1 12.23,110.1 ; 12.14,58.25 12.14,55.65 ; SW47.2 45.31,33.57 SW45.2 ; RV2.1 12.14,40.57 ; 12.14,40.57 12.61,40.09 RV1.1 ; 12.14,40.57 12.14,55.65 ; 12.23,110.1 12.73,110.6 22.44,110.6 26.92,106.11 Screen1.2
5VDC: length 149.4
  Top Layer w0.254: C9.1 77.98,96.75 v1(82.98,101.75) 84.4,101.75 86.78,104.13 86.78,110.58 86.7,110.66 86.62,110.66 83.92,113.36 83.92,117.89 84.81,118.79 84.81,120.05 83.92,120.95 83.67,120.95 80.8,123.82 v1(80.8,126.36) ; U8.14 62.74,135.38 U5.7 56.1,136.56 34.25,136.56 v1(33.9,136.21) ; C8.1 77.4,102.47 v1(78.89,103.96) ; v1(66.74,138.8) C10.2 77.7,138.18 v1(82.56,133.32) ; R4.2 70.16,143.26 v1(69.69,143.74)
  Bottom Layer w0.254: v1(33.9,136.21) 29.11,136.21 19.45,145.87 SW49.5 ; v1(82.56,133.32) 80.8,131.56 v1(80.8,126.36) ; v1(78.89,103.96) 81.09,101.75 v1(82.98,101.75) ; v1(69.69,143.74) 66.74,140.8 v1(66.74,138.8) 64.14,136.2 U8.14
GND: length 1307.6
  Top Layer w0.254: 17.1,157.38 22.99,157.38 SW49.3 ; 17.1,157.38 SW49.1 ; 17.1,157.38 6.03,157.38 ; 73.46,93.37 73.46,92.06 135.6,92.06 137.05,90.61 155.13,90.61 ; 73.46,93.37 C9.2 ; 73.46,93.37 ROW_MUX1.12 63.44,93.37 ; C36.2 98.87,6 101.6,8.74 101.6,23.79 ; 19.13,62.78 D58.1 D58.2 39.45,76.09 C3.1 ; 19.13,62.78 17.23,60.88 RV3.3 19.01,56.58 RV2.4 17.11,47.57 ; 19.13,62.78 RV3.4 ; C49.2 176.58,136.14 176.66,136.23 ; 176.66,136.23 177.24,136.23 178.08,135.39 178.08,128.14 181.16,125.06 C31.2 181.16,108.52 184.54,105.15 184.54,94.22 181.87,91.56 166.01,91.56 165.16,90.71 C32.2 155.2,90.68 155.13,90.61 ; 176.66,136.23 R62.2 176.72,136.96 176.72,143.3 ; 99.28,145.66 98.65,145.03 92.96,145.03 R22.1 92.2,138.85 89.41,136.06 ; 99.28,145.66 R52.1 ; 99.28,145.66 J4.4 ; 57.75,115.04 COL_MUX1.3 ; 57.75,115.04 58.1,114.69 58.1,110.28 62.22,106.15 COL_MUX1.15 73.56,106.15 73.74,105.97 ; 57.75,115.04 57.75,115.09 59.61,116.95 ; C4.1 59.61,116.95 ; 59.61,116.95 67.12,116.95 71.75,121.58 U8.4 ; 73.74,105.97 C8.2 ; 73.74,105.97 75.72,105.97 77.09,107.34 C7.1 77.85,111.31 C2.2 ; 153.29,143.51 153.29,143 ; 153.29,143.51 R48.1 ; 153.29,143.51 147.79,143.51 147.79,143.29 147.56,143.07 134.75,143.07 ; 153.29,143 R50.2 ; 153.29,143 C40.2 159,149.76 J7.4 ; RV3.5 RV3.4 ; RV3.4 13.54,70.94 13.54,78.85 14.46,79.77 14.46,80.25 8.37,86.35 8.37,90.93 ; 190.31,144.34 R64.1 194.63,143.13 ; 190.31,144.34 C57.2 190.31,149.89 187.3,152.91 J8.4 ; 190.31,144.34 189.27,143.3 176.72,143.3 ; 89.41,136.06 90.08,135.39 R24.2 ; 89.41,136.06 C12.2 ; 7.49,146.95 C5.1 2.63,141.06 LEDPWR1.1 ; 7.49,146.95 6.55,146.95 3.33,150.18 3.33,154.33 ; 7.49,146.95 16.94,146.95 C6.1 ; 101.6,23.79 17.61,23.79 ; 101.6,23.79 104.74,26.92 C35.2 114.87,31.42 119.62,36.16 119.62,47.45 ; 17.61,23.79 RV1.3 ; 17.61,23.79 17.61,30.17 ; 6.03,157.38 6.03,157.04 3.33,154.33 ; 6.03,157.38 J1.2 ; 19.51,30.17 17.61,30.17 ; 17.61,30.17 17.11,30.17 ; C46.2 132.84,136.9 R58.2 134.75,137.05 ; R60.1 176.72,143.3 ; 134.75,137.05 117.74,137.05 C43.2 111.62,136.02 R54.2 ; 134.75,137.05 134.75,143.07 ; 119.62,47.45 79.49,47.45 C58.2 ; 119.62,47.45 119.62,47.7 120.17,48.26 131.38,48.26 C34.2 ; 155.13,90.61 155.13,78.94 148.91,72.71 C33.2 ; 17.11,47.57 RV2.5 ; 17.11,47.57 RV2.3 17.11,30.17 ; C10.1 65.34,135.32 U8.13 ; 8.37,90.93 C56.2 13.07,104.01 Screen1.1 ; 8.37,90.93 C54.2 ; COL_MUX1.12 55.57,101.24 63.44,93.37 ; 3.33,154.33 1.33,154.33 ; R66.2 194.56,143.07 194.63,143.13 ; 194.63,143.13 C52.2 ; ROW_MUX1.23 ROW_MUX1.22 ROW_MUX1.21 ROW_MUX1.20 ROW_MUX1.19 ROW_MUX1.18 ROW_MUX1.17 ROW_MUX1.16 ROW_MUX1.15 60.9,90.83 63.44,93.37 ; R56.1 134.75,143.07 ; 17.11,30.17 RV1.5
  Bottom Layer w0.254: SW49.3 23.8,161.09 26.56,163.85 ; J5.2 120.61,158.56 ; 120.61,158.56 J5.3 119.14,157.01 ; 120.61,158.56 141.44,158.56 ; 58.46,130.3 62.4,126.36 U8.1 ; 58.46,130.3 U5.5 56.12,131.46 56.12,136.76 U5.8 57.28,145.24 52.33,150.19 J2.2 47.67,148.66 30.04,148.66 26.56,152.15 26.56,163.85 ; 58.46,130.3 62.99,130.3 U8.13 U8.12 U8.11 ; U8.7 U8.8 ; U8.8 U8.9 75.61,133.99 ; U8.8 99.28,153.89 ; J6.2 141.44,158.56 ; 141.44,158.56 J6.3 ; RV3.5 7.99,65.35 2.54,70.79 U1.G1 3.74,117.27 3.74,131.32 ; U8.4 U8.11 ; U8.11 U8.10 75.61,133.99 ; 75.61,133.99 J3.2 ; 99.28,153.89 J4.3 99.28,157.01 ; 99.28,153.89 J4.4 ; J9.2 205.58,157.78 ; 205.58,157.78 183.86,157.78 ; 205.58,157.78 J9.3 J9.4 ; 3.74,131.32 U1.G3 ; 3.74,131.32 3.74,132.51 2.54,132.51 1.33,133.71 1.33,154.33 ; J8.4 183.74,153.02 183.74,156.89 J8.3 183.86,157.78 ; 183.86,158.56 183.86,157.78 ; 183.86,158.56 J8.2 ; 183.86,158.56 162.14,158.56 ; 162.14,158.56 J7.3 160.67,157.01 ; 162.14,158.56 J7.2 ; J6.3 J6.4 ; J6.3 160.67,157.01 ; 119.14,157.01 119.14,154.38 J5.4 ; 119.14,157.01 99.28,157.01 ; 160.67,157.01 160.67,154.38 J7.4 ; 26.56,163.85 D44.2 ; 99.28,157.01 J4.2
VIN_FUSED: length 112.3
  Top Layer w0.254: v1(22.68,150.11) 21.98,150.11 ; 21.98,150.11 21.98,145.54 ; 21.98,150.11 U6.1 ; SW49.6 21.45,154.89 20.36,153.8 19.1,153.8 F1.2 ; v1(15.16,145.73) 13.03,145.73 C5.2 ; 21.98,145.54 21.98,145.29 24.1,143.17 24.1,130 26.19,130 26.78,130.59 26.78,132.12 26.89,132.23 26.89,152.22 D44.1 ; 21.98,145.54 C6.2
  Bottom Layer w0.254: 23.8,151.47 22.68,150.35 v1(22.68,150.11) ; 23.8,151.47 23.8,154.99 ; 23.8,151.47 23.8,147.78 34.63,136.94 34.63,135.47 24.89,135.47 15.16,145.21 v1(15.16,145.73) ; 23.8,154.99 SW49.6 ; 23.8,154.99 SW49.4
VIN_RAW: length 7.8
  Top Layer w0.254: J1.1 NOREF#14.TP2 13.74,151.33 F1.1
(no net): length 0.8
  Top Layer w0.254: SW19.3 162.21,81.71
CNTRLLP: length 168.1
  Top Layer w0.635: v1(195.33,156.84) 195.33,157.46 D51.4 ; v1(196.6,131.57) 200.28,131.57 203.31,128.54 203.31,16.58 195.21,8.47 191.75,8.47 D42.3
  Bottom Layer w0.635: v1(195.33,156.84) 196.6,155.57 v1(196.6,131.57)
COL1: length 153.1
  Top Layer w0.254: v1(61.59,110.62) 61.64,110.57 63.46,110.57 63.51,110.53 67.08,110.53 67.93,111.38 70.87,111.38 71.59,112.1 71.59,112.72 71.75,112.88 72.37,112.88 v1(74.42,114.94) ; COL_MUX1.9 60.13,107.42 v1(60.22,107.33) ; SW2.2 109.23,121.1 99.1,121.1 SW1.2 88.08,116.71 87.48,116.71 87.45,116.74 86.96,116.74 86.93,116.71 v1(85.09,116.71) ; SW6.2 164.66,120.97 151.01,120.97 SW5.2 143.36,113.33 133.86,113.33 132.18,115.01 SW4.2 130.5,121.1 117.61,121.1 SW3.2
  Bottom Layer w0.254: v1(85.09,116.71) 76.2,116.71 v1(74.42,114.94) ; SW7.2 181.04,121.1 167.9,121.1 SW6.2 ; SW3.2 112.42,122.92 SW2.2 ; v1(60.22,107.33) 61.59,108.71 v1(61.59,110.62)
COL2: length 144.6
  Top Layer w0.254: SW9.2 99.67,100.66 ; 99.67,100.66 115.8,100.66 115.92,100.53 ; 99.67,100.66 85.22,100.66 SW8.2 ; 166.09,100.15 149.45,100.15 ; 166.09,100.15 SW13.2 ; 166.09,100.15 181.17,100.15 SW14.2 ; 149.45,100.15 SW12.2 ; 149.45,100.15 149.2,100.4 132.43,100.4 ; v1(74.17,99.95) 61.59,99.95 60.83,100.71 ; 132.43,100.4 132.31,100.53 115.92,100.53 ; 132.43,100.4 SW11.2 ; 115.92,100.53 SW10.2 ; v1(58.42,108.84) 58.27,108.69 COL_MUX1.8
  Bottom Layer w0.254: v1(58.42,108.84) 58.42,106.68 60.83,104.27 v1(60.83,100.92) ; SW8.2 75.14,98.97 v1(74.17,99.95)
COL3: length 615.7
  Top Layer w0.254: SW15.2 83.67,69.49 94.23,58.92 183.82,58.92 184.79,57.96 184.79,54.75 ; v1(57.2,109.77) 55.76,109.77 COL_MUX1.7 ; 184.79,54.75 184.79,19.17 191.38,12.58 197.14,12.58 197.94,13.38 197.94,119.79 196.66,121.06 193.79,121.06 193.11,120.38 193.11,87.77 182.98,77.64 SW21.2 181.3,79.19 167.77,79.19 SW20.2 165.06,77.51 163.07,79.5 v1(156.85,79.5) ; 184.79,54.75 61.17,54.75 v1(59.95,55.97) ; 115.67,75.78 95.32,75.78 94.48,76.62 94.48,79.7 97.99,79.7 SW16.2 ; 115.67,75.78 SW17.2 ; 115.67,75.78 130.57,75.78 SW18.2 134.12,79.32 147.9,79.32 SW19.2
  Bottom Layer w0.254: v1(59.95,55.97) 59.95,75.58 57.2,78.34 v1(57.2,109.77) ; SW19.2 154.85,77.51 v1(156.85,79.5)
COL4: length 185.1
  Top Layer w0.254: 149.71,58.11 166.09,58.11 ; 149.71,58.11 SW26.2 ; 149.71,58.11 149.45,58.36 132.69,58.36 ; 166.09,58.11 181.55,58.11 SW28.2 ; 166.09,58.11 SW27.2 ; 115.67,58.49 132.56,58.49 132.69,58.36 ; 115.67,58.49 99.8,58.49 ; 115.67,58.49 SW24.2 ; 132.69,58.36 SW25.2 ; 99.8,58.49 SW23.2 ; 99.8,58.49 85.35,58.49 SW22.2 83.54,56.81 71.81,68.54 71.81,74.59 66.37,80.03 53.52,80.03 53.52,110.1 54.65,111.23 COL_MUX1.6
COL5: length 300.1
  Top Layer w0.254: 166.09,36.9 181.68,36.9 SW35.2 ; 166.09,36.9 149.83,36.9 ; 166.09,36.9 SW34.2 ; SW33.2 149.83,36.9 ; 149.83,36.9 149.58,37.16 134.37,37.16 SW32.2 131.01,37.16 131.01,46.46 131.67,47.12 132.33,47.12 132.33,48.74 130.99,50.09 78.21,50.09 77.86,50.44 77.86,50.79 76.33,50.79 76.33,42.94 SW29.2 85.35,37.28 99.92,37.28 ; 99.92,37.28 SW30.2 ; 99.92,37.28 113.99,37.28 SW31.2 ; COL_MUX1.5 54.77,112.5 53.94,113.33 53.94,115.68 57.2,115.68 57.2,120.2 58.75,121.76 60.31,121.76 60.31,120 62.83,120 v1(63.17,120.35)
  Bottom Layer w0.254: v1(63.17,120.35) 72.52,120.35 72.52,90.61 72.64,90.61 72.75,90.5 72.75,46.51 SW29.2
COL6: length 497.5
  Top Layer w0.254: 149.83,15.56 149.58,15.82 132.69,15.82 ; 149.83,15.56 SW40.2 ; 149.83,15.56 166.09,15.56 ; SW37.2 98.24,16.07 85.48,16.07 SW36.2 50.21,14.39 v1(49.53,13.71) ; COL_MUX1.4 55.08,114.25 v1(55.01,114.25) ; 132.69,15.82 117.23,15.82 SW38.2 ; 132.69,15.82 SW39.2 ; 166.09,15.56 SW41.2 ; 166.09,15.56 166.34,15.82 181.55,15.82 SW42.2
  Bottom Layer w0.254: SW37.2 99.94,14.37 108.77,14.37 109.93,15.53 109.93,92.74 102.02,100.66 96.27,100.66 94.1,102.82 94.1,126.1 117.61,126.1 117.61,16.2 SW38.2 ; v1(55.01,114.25) 53.99,114.25 49.27,109.54 49.27,13.97 v1(49.53,13.71)
CTRL1: length 139.1
  Top Layer w0.254: COL_MUX1.2 53.11,116.31 53.11,78.68 59.31,78.68 60.2,77.79 60.2,76.77 60.3,76.66 60.3,75.53 60.2,75.42 60.2,61.29 58.91,60 36.65,60 36.65,40.01 50.83,40.01 50.83,56.56 SW43.1
CTRL2: length 95.5
  Top Layer w0.254: COL_MUX1.23 61.95,116.31 v1(61.13,115.48)
  Bottom Layer w0.254: v1(61.13,115.48) 47.23,115.48 43.63,111.88 43.63,46.69 SW44.1
CTRL3: length 97.6
  Top Layer w0.254: COL_MUX1.22 63.94,115.04 63.43,114.53 v1(58.68,114.53)
  Bottom Layer w0.254: SW45.1 56.08,31.83 56.08,111.92 v1(58.68,114.53)
CTRL4: length 90.8
  Top Layer w0.254: v1(64.52,114.23) 64.6,114.23 COL_MUX1.21
  Bottom Layer w0.254: v1(64.52,114.23) 64.49,114.19 64.49,84.54 64.52,84.51 64.55,84.51 64.55,32.67 SW46.1
CTRL5: length 75.3
  Top Layer w0.254: COL_MUX1.20 62.75,112.5 v1(62.34,112.09)
  Bottom Layer w0.254: v1(62.34,112.09) 62.34,46.09 SW47.1
CTRL6: length 57.6
  Top Layer w0.254: COL_MUX1.19 65.06,111.73 v1(65.07,111.74)
  Bottom Layer w0.254: SW48.1 65.07,62 v1(65.07,111.74)
E1: length 71
  Top Layer w0.254: U1.14 33.02,136.52 35.88,139.39 80.83,139.39 C12.1 85.66,134.56 94.42,134.56 R25.2
E2: length 100
  Top Layer w0.254: 113.92,134.99 R55.2 ; 113.92,134.99 111.51,132.57 59.28,132.57 58.46,133.39 58.46,134.21 44.39,134.21 44.01,134.59 44.01,134.98 34.74,134.98 34.12,134.35 34.12,130.13 31.67,130.13 U1.15 ; 113.92,134.99 121.02,134.99 C43.1
E3: length 201.7
  Top Layer w0.254: C46.1 127.65,134.99 134.01,134.99 134.01,136.14 137.04,136.14 R59.2 137.92,137.02 141.18,137.02 142.06,136.14 152.69,136.14 152.74,136.09 156.76,136.09 156.97,136.3 156.97,136.86 157.07,136.96 157.07,139.49 159.68,142.1 161.03,142.1 162.29,143.35 162.29,151.17 162.74,151.63 163.2,151.63 163.2,154.44 160.98,154.44 160.62,154.08 160.37,154.08 160.22,153.93 159.57,153.93 159.42,154.08 142.64,154.08 142.36,154.35 140.05,154.35 139.78,154.08 139.67,154.08 139.51,153.93 138.87,153.93 138.72,154.08 122.43,154.08 120.92,155.59 108.22,155.59 108.16,155.52 104.24,155.52 104.17,155.59 87.61,155.59 71.94,139.92 35.58,139.92 28.07,132.41 28.07,131.44 U1.16
E4: length 317.7
  Top Layer w0.254: C40.1 164.34,156.87 162.89,158.32 30.73,158.32 26.48,154.07 26.48,132.4 U1.17 ; v1(154.75,136.73) 154.79,136.77 R51.2
  Bottom Layer w0.254: v1(154.75,136.73) 154.75,136 151.41,132.66 85.46,132.66 81.6,128.79 81.6,125.96 80.57,124.93 31.78,124.93 U1.17
E5: length 254.1
  Top Layer w0.254: R63.2 178.94,136.77 179.81,135.91 179.81,134.08 181.1,132.78 199.47,132.78 202.64,135.95 202.64,152.05 200.59,154.1 184.27,154.1 184.18,154.19 183.54,154.19 183.45,154.1 182.93,154.1 182.93,152.18 181.96,151.22 181.84,151.22 181.02,150.4 176.72,150.4 176.6,150.27 166.56,150.27 166.43,150.4 166.43,138.24 C49.1 ; U1.20 18.03,131.32 19.05,132.33 19.05,150.31 20.66,151.91 20.66,151.98 20.82,152.14 22.11,152.14 28.73,158.76 74.94,158.76 75.43,159.26 80.77,159.26 84.69,163.18 149.11,163.18
E6: length 344.4
  Top Layer w0.254: C52.1 205.92,143.95 v1(205.92,145.22) ; v1(180.59,137.17) 181.62,136.14 196.1,136.14 R67.2
  Bottom Layer w0.254: v1(180.59,137.17) 180.59,134.06 178.63,132.1 135.17,132.1 ; 135.17,132.1 134.91,131.84 91.77,131.84 87.05,127.12 87.05,124.84 84.61,122.4 73.72,122.4 73.47,122.66 69.79,122.66 69.53,122.4 23.02,122.4 15.24,130.18 U1.21 ; 135.17,132.1 135.17,97.14 136.41,95.9 137.65,95.9 137.65,120.47 143.28,126.1 194.81,126.1 205.92,137.22 v1(205.92,145.22)
FP1: length 176.2
  Top Layer w0.254: v1(83.11,21.83) 16.46,21.83 RV1.2 ; v1(75.11,106.55) 75.32,106.77 75.32,108.69 COL_MUX1.17
  Bottom Layer w0.254: v1(75.11,106.55) 84.04,106.55 85.35,105.25 85.35,24.07 v1(83.11,21.83)
FP2: length 206.1
  Top Layer w0.254: v1(74.74,107.71) 65.35,107.71 COL_MUX1.16 ; v1(88.53,22.2) 87.42,21.09 12.64,21.09 8.78,24.94 8.78,34.75 RV2.2
  Bottom Layer w0.254: v1(74.74,107.71) 83.72,107.71 87.23,104.2 87.23,23.5 v1(88.53,22.2)
LED: length 67.6
  Top Layer w0.254: v1(57.76,127.07) 61.84,127.07 61.84,124.93 66.67,124.93 U8.2 ; v1(23.99,123.72) 20.32,120.05 U1.6
  Bottom Layer w0.254: v1(23.99,123.72) 23.99,132.51 36.76,132.51 36.76,130.82 38.45,129.13 56.03,129.13 57.76,127.4 v1(57.76,127.07)
LEDCNTRL: length 18.7
  Top Layer w0.254: v1(87.21,116.16) 88.16,115.2 D1.4 ; v1(77.15,112.22) 72.24,112.22 R20.2
  Bottom Layer w0.254: v1(77.15,112.22) 83.26,112.22 v1(87.21,116.16)
MAIN: length 91.6
  Top Layer w0.254: 58.93,108.08 58.9,108.1 54.13,108.1 v1(54.1,108.08) ; COL_MUX1.18 64.82,109.73 v1(60.58,109.73) ; v1(19.56,92.2) 29.21,101.85 50.93,101.85 v1(52.32,103.25)
  Bottom Layer w0.254: v1(60.58,109.73) 59.14,108.28 v1(59.14,108.08) ; RV3.2 14.73,78.33 13.29,79.77 13.29,80.25 14.73,81.69 14.73,87.38 v1(19.56,92.2) ; v1(52.32,103.25) 52.32,106.3 v1(54.1,108.08)
MIDI_OUT: length 36.5
  Top Layer w0.254: v1(74.71,129.47) 72.61,131.57 v1(57.29,131.57) ; v1(61.76,141.45) 61.76,143.18 R19.2
  Bottom Layer w0.254: v1(74.71,129.47) 76.84,127.35 U8.6 ; v1(61.76,141.45) 61.76,135.25 58.09,131.57 v1(57.29,131.57)
MIDI_RX: length 653.7
  Top Layer w0.254: R2.2 43.56,133.73 47.47,133.73 48.5,132.7 48.5,131.67 55.96,131.67 57.14,132.84 U5.6 ; U1.0 5.21,116.2 5.33,116.2 5.86,115.68 5.86,100.59 5.38,100.1 5.38,98.52 5.73,98.18 5.73,50.84 5.26,50.37 5.26,49.88 5.42,49.72 5.42,30.84 4.95,30.37 4.95,29.88 5.41,29.42 5.59,29.42 5.86,29.15 5.86,15.83 19.32,2.38 125.11,2.38 125.11,3.39 126.13,4.4 126.82,4.4 127.17,4.75 143.31,4.75 143.4,4.67 153.26,4.67 153.34,4.75 154.04,4.75 154.32,5.03 192.84,5.03 204.13,16.32 204.13,119.55 203.96,119.73 203.96,120.21 207.6,123.85 207.6,160.4 203.79,164.2 192.43,164.2 192.05,164.58 64.9,164.58 v1(64.77,164.46)
  Bottom Layer w0.254: v1(64.77,164.46) 61.02,160.71 61.02,136.59 U5.6
MIDI_TX: length 471
  Top Layer w0.254: U8.5 75.71,127.78 165.94,127.78 169.03,124.69 v1(169.03,118.27) ; v1(8.15,66.38) 8.3,66.38 8.55,66.12 8.55,64.46 9.04,63.98 9.04,49.07 8.43,48.46 8.43,46.68 9.04,46.07 9.04,35.58 8.37,34.91 8.37,24.78 12.47,20.68 14.49,20.68 20.89,14.28 48.13,14.28 49.29,13.12 81.63,13.12 81.89,12.86 100.95,12.86 101.2,12.62 101.2,9.84 v1(101.02,9.67)
  Bottom Layer w0.254: v1(169.03,118.27) 169.33,117.98 169.33,14.29 164.7,9.67 v1(101.02,9.67) ; U1.1 7.62,66.91 v1(8.15,66.38)
MRC: length 37.5
  Top Layer w0.254: COL_MUX1.1 55.57,118.34 54.93,118.98 41.32,118.98 35.61,113.27 v1(28.91,113.27)
  Bottom Layer w0.254: v1(28.91,113.27) 25.28,113.27 22.86,115.69 U1.7
MRR: length 664.1
  Top Layer w0.254: v1(130.71,56.56) 130.71,56.26 129.66,55.22 68.74,55.22 65.07,58.88 ROW_MUX1.1 ; v1(204.54,119.97) 204.54,14.68 191.61,1.75 18.72,1.75 2.9,17.57 2.9,114.38 3.4,114.89 3.91,114.89 3.91,132.51 11.51,132.51 U1.22
  Bottom Layer w0.254: v1(130.71,56.56) 130.71,69.81 143,82.1 143,120.82 143.84,121.66 202.85,121.66 v1(204.54,119.97)
MUXC1: length 111.9
  Top Layer w0.254: U1.8 25.4,118.16 34.74,127.51 v1(35.57,127.51) ; v1(56.88,127.09) 56.88,127.8 72.94,127.8 72.94,122.73 77.93,117.74 78.74,117.74 82.92,113.56 82.92,106.8 77.89,101.77 72.91,101.77 71.23,103.45 67.24,103.45 66.84,103.85 66.84,104.25 63.43,104.25 63.43,104.92 62.75,105.6 56.12,105.6 COL_MUX1.10
  Bottom Layer w0.254: v1(35.57,127.51) 56.45,127.51 v1(56.88,127.09)
MUXC2: length 66.8
  Top Layer w0.254: v1(66.96,102.61) 66.96,102.44 57.99,102.44 57.99,104.88 COL_MUX1.11
  Bottom Layer w0.254: U1.9 29.13,114.89 36.76,114.89 36.76,115.82 37.69,116.74 63.2,116.74 65.81,114.14 65.81,103.77 v1(66.96,102.61)
MUXC3: length 50.5
  Top Layer w0.254: v1(67.49,104.52) 67.13,104.88 COL_MUX1.14
  Bottom Layer w0.254: U1.10 31.67,117.27 63.52,117.27 67.49,113.29 v1(67.49,104.52)
MUXC4: length 128.6
  Top Layer w0.254: v1(58.57,103.03) 59.16,103.61 COL_MUX1.13 ; v1(59.37,77.55) 39.35,77.55 v1(24.83,92.08) ; v1(32.75,118.52) 33.02,118.25 U1.11
  Bottom Layer w0.254: v1(59.37,77.55) 59.37,102.23 v1(58.57,103.03) ; v1(24.83,92.08) 28.21,95.46 28.21,111.48 20.29,111.48 16.61,115.17 16.61,116.99 18.59,118.97 32.29,118.97 v1(32.75,118.52)
MUXR1: length 185.9
  Top Layer w0.254: v1(20.69,61.88) 20.69,48.55 20.78,48.46 20.78,46.68 20.69,46.59 20.69,44.06 25.29,39.46 70.07,39.46 v1(70.25,39.64) ; U1.2 16.51,109.73 v1(19.05,109.73) ; ROW_MUX1.10 67.37,90.83 v1(67.5,90.96)
  Bottom Layer w0.254: v1(67.5,90.96) 71.79,86.67 71.79,41.18 v1(70.25,39.64) ; v1(20.69,61.88) 20.69,64.24 20.91,64.46 20.91,66.24 20.69,66.46 20.69,108.08 v1(19.05,109.73)
MUXR2: length 297.4
  Top Layer w0.254: v1(20.12,35.03) 66.83,35.03 70.89,39.09 70.89,48.07 71.12,48.3 v1(75.43,48.3) ; ROW_MUX1.11 72.21,92.1 v1(73.1,91.2) ; v1(0.68,134.97) 15.77,134.97 16.44,134.31 16.44,119.81 U1.3
  Bottom Layer w0.254: v1(20.12,35.03) 13.8,28.7 13.8,21.99 7.24,21.99 0.68,28.55 v1(0.68,134.97) ; v1(73.1,91.2) 81.86,82.45 81.86,54.73 v1(75.43,48.3)
MUXR3: length 69.8
  Top Layer w0.254: v1(54.23,92.1) ROW_MUX1.14 ; v1(27.63,110.57) 43.63,110.57 v1(46.09,113.02)
  Bottom Layer w0.254: v1(46.09,113.02) 48.02,114.96 55.63,114.96 55.63,93.5 v1(54.23,92.1) ; U1.4 15.24,115.69 19.92,111.01 27.63,111.01 v1(27.63,110.57)
MUXR4: length 65.7
  Top Layer w0.254: ROW_MUX1.13 55.58,95.03 v1(54.64,95.97) ; v1(25.4,95.25) 33.02,87.63 v1(51.25,87.63) ; v1(21.83,110.02) 17.78,114.06 U1.5
  Bottom Layer w0.254: v1(51.25,87.63) 51.25,92.59 v1(54.64,95.97) ; v1(21.83,110.02) 21.83,98.82 v1(25.4,95.25)
ROW1: length 206.4
  Top Layer w0.254: v1(87.63,122.07) 85.28,124.42 SW1.1 ; SW15.1 97.85,76.34 113.85,76.34 113.85,84.42 110.77,87.5 86.37,87.5 84.32,89.56 ROW_MUX1.9
  Bottom Layer w0.254: 94.48,91.84 94.48,79.7 SW15.1 97.85,76.34 97.85,56.81 ; 94.48,91.84 87.87,98.45 87.87,121.83 v1(87.63,122.07) ; 94.48,91.84 94.48,97.42 SW8.1 ; SW36.1 97.85,15.95 97.85,35.6 ; 97.85,56.81 97.85,35.6 ; 97.85,56.81 SW22.1 ; 97.85,35.6 SW29.1
ROW2: length 173.4
  Top Layer w0.254: ROW_MUX1.8 65.86,88.29 72.81,81.34 108.85,81.34 SW16.1
  Bottom Layer w0.254: 113.85,78.02 SW16.1 ; 113.85,78.02 113.85,56.81 ; 113.85,78.02 113.85,97.29 SW9.1 110.49,100.66 110.49,114.77 100.96,124.29 SW2.1 ; 114.1,35.6 114.1,16.07 SW37.1 ; 114.1,35.6 SW30.1 ; 114.1,35.6 114.1,56.56 113.85,56.81 ; 113.85,56.81 SW23.1
ROW3: length 190
  Top Layer w0.254: SW17.1 128.17,78.91 116.46,90.61 68.67,90.61 67.74,91.54 66.36,91.54 66.21,91.39 63.93,91.39 63.74,91.21 63.44,91.21 63.44,88.86 63.6,88.71 63.6,88.05 64.63,87.02 ROW_MUX1.7
  Bottom Layer w0.254: SW38.1 129.85,15.95 129.85,35.47 ; SW10.1 129.85,98.85 ; 129.85,98.85 130.11,99.1 130.11,117.74 SW3.1 ; 129.85,98.85 129.85,77.89 ; 129.85,56.81 129.85,53.17 130,53.03 130.14,53.03 130.14,35.76 129.85,35.47 ; 129.85,56.81 129.85,68.93 130.07,69.15 130.28,69.15 130.28,77.46 129.85,77.89 ; 129.85,56.81 SW24.1 ; 129.85,35.47 SW31.1 ; 129.85,77.89 SW17.1
ROW4: length 270.9
  Top Layer w0.254: ROW_MUX1.6 64.87,85.94 v1(63.17,85.94)
  Bottom Layer w0.254: 146.62,98.72 146.62,87.21 ; 146.62,98.72 146.62,117.48 SW4.1 ; 146.62,98.72 SW11.1 ; 146.62,87.21 146.87,86.96 146.87,56.68 ; 146.62,87.21 146.62,79.32 SW18.1 ; 146.87,35.47 146.87,15.82 SW39.1 143.51,12.45 79.62,12.45 63,29.08 63,85.77 v1(63.17,85.94) ; 146.87,35.47 146.87,56.68 ; 146.87,35.47 SW32.1 ; 146.87,56.68 SW25.1
ROW5: length 392.4
  Top Layer w0.254: 65.07,83.84 64.05,83.84 v1(63.96,83.93) ; 65.07,83.84 ROW_MUX1.4 ; 65.07,83.84 ROW_MUX1.5
  Bottom Layer w0.254: 163.63,98.47 SW12.1 ; 163.63,98.47 163.63,117.48 SW5.1 ; 163.63,98.47 163.74,98.36 163.74,77.51 ; 163.74,56.43 164.01,56.15 164.01,35.22 ; 163.74,56.43 163.74,77.51 ; 163.74,56.43 SW26.1 ; v1(63.96,83.93) 63.96,84.18 63.93,84.22 63.93,114.13 61.72,116.34 46.99,116.34 43.07,112.42 43.07,58.4 36.77,52.1 36.77,25.53 50.33,11.97 56.65,11.97 56.91,11.72 57.39,11.72 57.65,11.97 160.17,11.97 162.08,13.88 SW40.1 162.33,16.72 160.8,18.25 160.8,19.52 163.82,22.54 163.82,28.27 163.89,28.33 163.89,35.09 164.01,35.22 ; 163.74,77.51 SW19.1 ; 164.01,35.22 SW33.1
ROW6: length 624.7
  Top Layer w0.254: ROW_MUX1.3 v1(63.59,81.94)
  Bottom Layer w0.254: SW13.1 180.27,98.47 ; 180.27,98.47 180.27,77.51 ; 180.27,98.47 180.72,98.92 180.72,117.74 ; 180.27,35.35 SW34.1 ; 180.27,35.35 180.27,15.82 SW41.1 ; 180.27,35.35 180.27,56.56 ; SW27.1 180.27,56.56 ; 180.27,56.56 180.27,77.51 ; 180.27,77.51 SW20.1 ; v1(63.59,81.94) 63.59,29.33 67.89,25.03 72.19,25.03 72.19,90.17 72.15,90.21 72.11,90.21 72.11,115.09 67.44,119.76 24.71,119.76 14.07,130.41 14.07,157.24 21.84,165.01 29.04,165.01 29.15,164.9 64.12,164.9 64.19,164.97 64.19,165.04 65.35,165.04 65.35,164.97 65.42,164.9 202.71,164.9 206.51,161.11 206.51,144.94 206.54,144.91 206.57,144.91 206.57,120.8 203.5,117.74 180.72,117.74 ; 180.72,117.74 180.4,117.74 SW6.1
ROW7: length 250
  Top Layer w0.254: ROW_MUX1.2 65.2,80.79 85.69,80.79 95.18,71.3 139.83,71.3 142.65,68.47 157.95,68.47 157.97,68.45 158.46,68.45 158.48,68.47 188.78,68.47 188.79,68.46 188.79,68.33 ; 193.67,98.47 193.67,79.32 SW21.1 195.48,75.01 188.8,68.33 188.79,68.33 ; 193.67,98.47 SW14.1 ; 193.67,98.47 193.67,117.86 SW7.1 ; 190.05,56.56 190.05,41.03 SW35.1 197.42,33.66 197.42,15.82 SW42.1 ; 190.05,56.56 SW28.1 ; 190.05,56.56 188.79,57.82 188.79,68.33
SCL: length 50.1
  Top Layer w0.254: U1.19 19.15,130.14 19.15,115.17 22.1,112.22 v1(24.82,112.22) ; R68.1 29.46,109.35 ; 29.46,109.35 R69.2 ; 29.46,109.35 Screen1.3
  Bottom Layer w0.254: Screen1.3 29.46,112.22 v1(24.82,112.22)
SDA: length 42.7
  Top Layer w0.254: Screen1.4 33.14,104.01 R68.2 ; U1.18 22.86,130.5 24.73,128.63 24.73,118.97 v1(23.99,118.24)
  Bottom Layer w0.254: v1(23.99,118.24) 23.99,115.4 25.06,114.33 29.05,114.33 32,111.37 Screen1.4
TPWR: length 38.3
  Top Layer w0.254: U1.VIN 2.54,133.46 v1(14.79,133.46)
  Bottom Layer w0.254: SW49.2 14.57,153.67 14.57,133.68 v1(14.79,133.46)
VLED: length 348.4
  Top Layer w0.254: v1(25.74,152.21) 25.74,150.5 U6.2
  Top Layer w0.635: v1(25.77,159.72) 26.03,159.72 26.32,159.42 28.54,159.42 28.73,159.61 63.66,159.61 64.29,160.25 75.85,160.25 77.44,161.84 77.44,162.81 81.66,162.81 82.3,163.45 82.93,163.45 83.36,163.87 183.68,163.87 187.98,159.58 187.98,157.39 187.72,157.14 ; 186.44,149.86 185.67,150.62 182.08,150.62 181.26,149.8 176.97,149.8 170.75,143.58 170.75,142.21 170.71,142.17 170.71,136.98 170.75,136.94 170.75,135.35 170.71,135.31 170.71,117.68 164.61,111.58 89.96,111.58 89.2,110.82 ; 186.44,149.86 C57.1 ; 186.44,149.86 v1(186.44,152.09) ; D1.1 88.16,109.79 89.2,110.82 ; 89.2,110.82 88.78,111.24 v1(87.16,111.24) ; 187.72,157.14 187.72,156.21 186.95,155.44 v1(185.6,155.44) ; 187.72,157.14 D51.1 ; C2.1 81.02,113.73 C7.2 74.77,113.73 v1(74.44,113.4)
  Bottom Layer w0.254: v1(25.74,152.21) 25.74,159.68 v1(25.77,159.72)
  Bottom Layer w0.635: v1(87.16,111.24) 76.59,111.24 v1(74.44,113.4) ; v1(186.44,152.09) 186.44,152.99 185.6,153.83 v1(185.6,155.44)
VREF: length 434.2
  Top Layer w0.254: 102.55,140.12 103.91,141.48 106.81,141.48 107.17,141.84 107.17,142.93 109.5,142.93 110.46,141.97 129.03,141.97 v1(129.03,142.49) ; 102.55,140.12 104.37,138.3 U21.5 ; 102.55,140.12 101.11,140.12 U21.3 ; v1(40.91,126.28) 43.17,128.54 R46.2 ; 182.77,139.83 178.24,139.83 v1(177.83,140.24) ; 182.77,139.83 U23.3 ; 182.77,139.83 182.77,137.81 188.75,137.81 U23.5 ; 70.21,98.97 59.83,98.97 57.2,101.61 57.2,104.25 54.05,104.25 54.05,95.22 v1(54.61,94.66) ; 70.21,98.97 72.67,98.97 74.16,97.49 74.16,95.74 77.39,92.5 132.78,92.5 v1(136.91,96.63) ; 70.21,98.97 v1(70.21,98.96) ; v1(51.25,110.33) 51.12,110.33 47.78,113.66 45.09,113.66 43.94,114.81 43.43,114.81 R47.2 ; U22.5 145.73,138.56 144.46,139.83 U22.3 141.71,139.83 139.61,137.73 136.67,137.73 v1(136.25,137.31) ; v1(58.46,125.71) 61.43,125.71 61.43,123.66 63.47,121.62 64.39,121.62 v1(67.49,118.52)
  Bottom Layer w0.254: v1(129.03,142.49) 129.03,140.91 132.64,137.31 ; v1(70.21,98.96) 70.21,115.8 v1(67.49,118.52) ; 132.64,137.31 132.64,138.99 141.83,148.19 155.39,148.19 163.33,140.24 v1(177.83,140.24) 177.83,142.08 180.9,145.15 187.45,145.15 188.25,144.34 188.25,138.26 181.53,131.54 147.88,131.54 136.91,120.57 v1(136.91,96.63) ; 132.64,137.31 v1(136.25,137.31) ; v1(58.46,125.71) 41.48,125.71 v1(40.91,126.28) ; v1(54.61,94.66) 53.49,93.54 53.49,88.38 52,86.89 50.52,86.89 50.52,109.59 v1(51.25,110.33)
$1N66295: length 115.7
  Top Layer w0.254: v1(99.6,7.73) 89.54,7.73 D36.4 ; D35.2 188.11,21.81 v1(188.11,16.78)
  Bottom Layer w0.254: v1(99.6,7.73) 100.61,6.72 102.29,6.72 102.6,7.04 125.26,7.04 125.58,6.72 180.25,6.72 188.25,14.72 188.25,16.64 v1(188.11,16.78)
$1N66297: length 24.5
  Top Layer w0.254: D15.2 95.38,67.48 v1(95.47,67.39) ; v1(93.07,74.48) 102.67,74.48 D16.4
  Bottom Layer w0.254: v1(95.47,67.39) 95.47,72.07 v1(93.07,74.48)
$1N66299: length 21.7
  Top Layer w0.635: D26.3 157.46,51.14 158.76,52.45 171.32,52.45 171.81,51.96 171.81,50.07 171.77,50.03 171.77,47.2 170.84,46.27 D27.1
$1N66303: length 35.6
  Top Layer w0.635: D29.3 91.54,30.44 92.85,31.75 105.86,31.75 105.86,30.55 106.83,29.58 106.83,29.11 107.1,28.84 108.49,28.84 109,29.35 111.85,29.35 v1(112.36,28.84) ; v1(112.33,25.8) 111.89,26.24 108.53,26.24 108.49,26.28 107.1,26.28 107.07,26.24 105.98,26.24 D30.1
  Bottom Layer w0.635: v1(112.33,25.8) 112.36,25.83 v1(112.36,28.84)
$1N66307: length 19
  Top Layer w0.635: D5.1 153.86,109.6 v1(145.29,109.6) ; v1(144.02,114.89) 140.44,114.89 D4.3
  Bottom Layer w0.635: v1(145.29,109.6) 145.29,113.62 v1(144.02,114.89)
$1N66319: length 24
  Top Layer w0.635: D23.3 107.67,52.25 107.93,52.51 111.72,52.51 111.77,52.56 112.26,52.56 112.31,52.51 122.51,52.51 v1(122.57,52.44) ; D24.1 120.88,46.72 v1(122.34,46.72)
  Bottom Layer w0.635: v1(122.34,46.72) 122.57,46.95 v1(122.57,52.44)
$1N66323: length 17.5
  Top Layer w0.635: v1(126.81,110.23) 136.34,110.23 D4.1 ; D3.3 125.35,114.64 v1(125.99,113.99)
  Bottom Layer w0.635: v1(125.99,113.99) 125.99,111.04 v1(126.81,110.23)
$1N66327: length 18.7
  Top Layer w0.254: v1(94.88,45.54) 92.27,45.54 D22.2 ; v1(95.83,51.34) 95.91,51.27 D23.4
  Bottom Layer w0.254: v1(94.88,45.54) 94.88,50.39 v1(95.83,51.34)
$1N66329: length 52.3
  Top Layer w0.635: D37.1 104.67,3.85 95.57,3.85 95.57,3.84 ; v1(110.54,10.26) 110.64,10.16 111.6,10.16 111.85,9.9 111.85,9.54 107.99,5.68 101.07,5.68 100.78,5.97 C36.1 ; v1(99.11,10.21) 92.78,10.21 D36.3
  Bottom Layer w0.254: v1(99.11,10.21) 99.11,10.42
  Bottom Layer w0.635: v1(95.56,3.86) 95.56,6.88 99.16,10.47 99.23,10.47 99.27,10.44 110.36,10.44 v1(110.54,10.26)
